# Altium schematic sheet SystemLevelAbbrev.SchDoc
size E
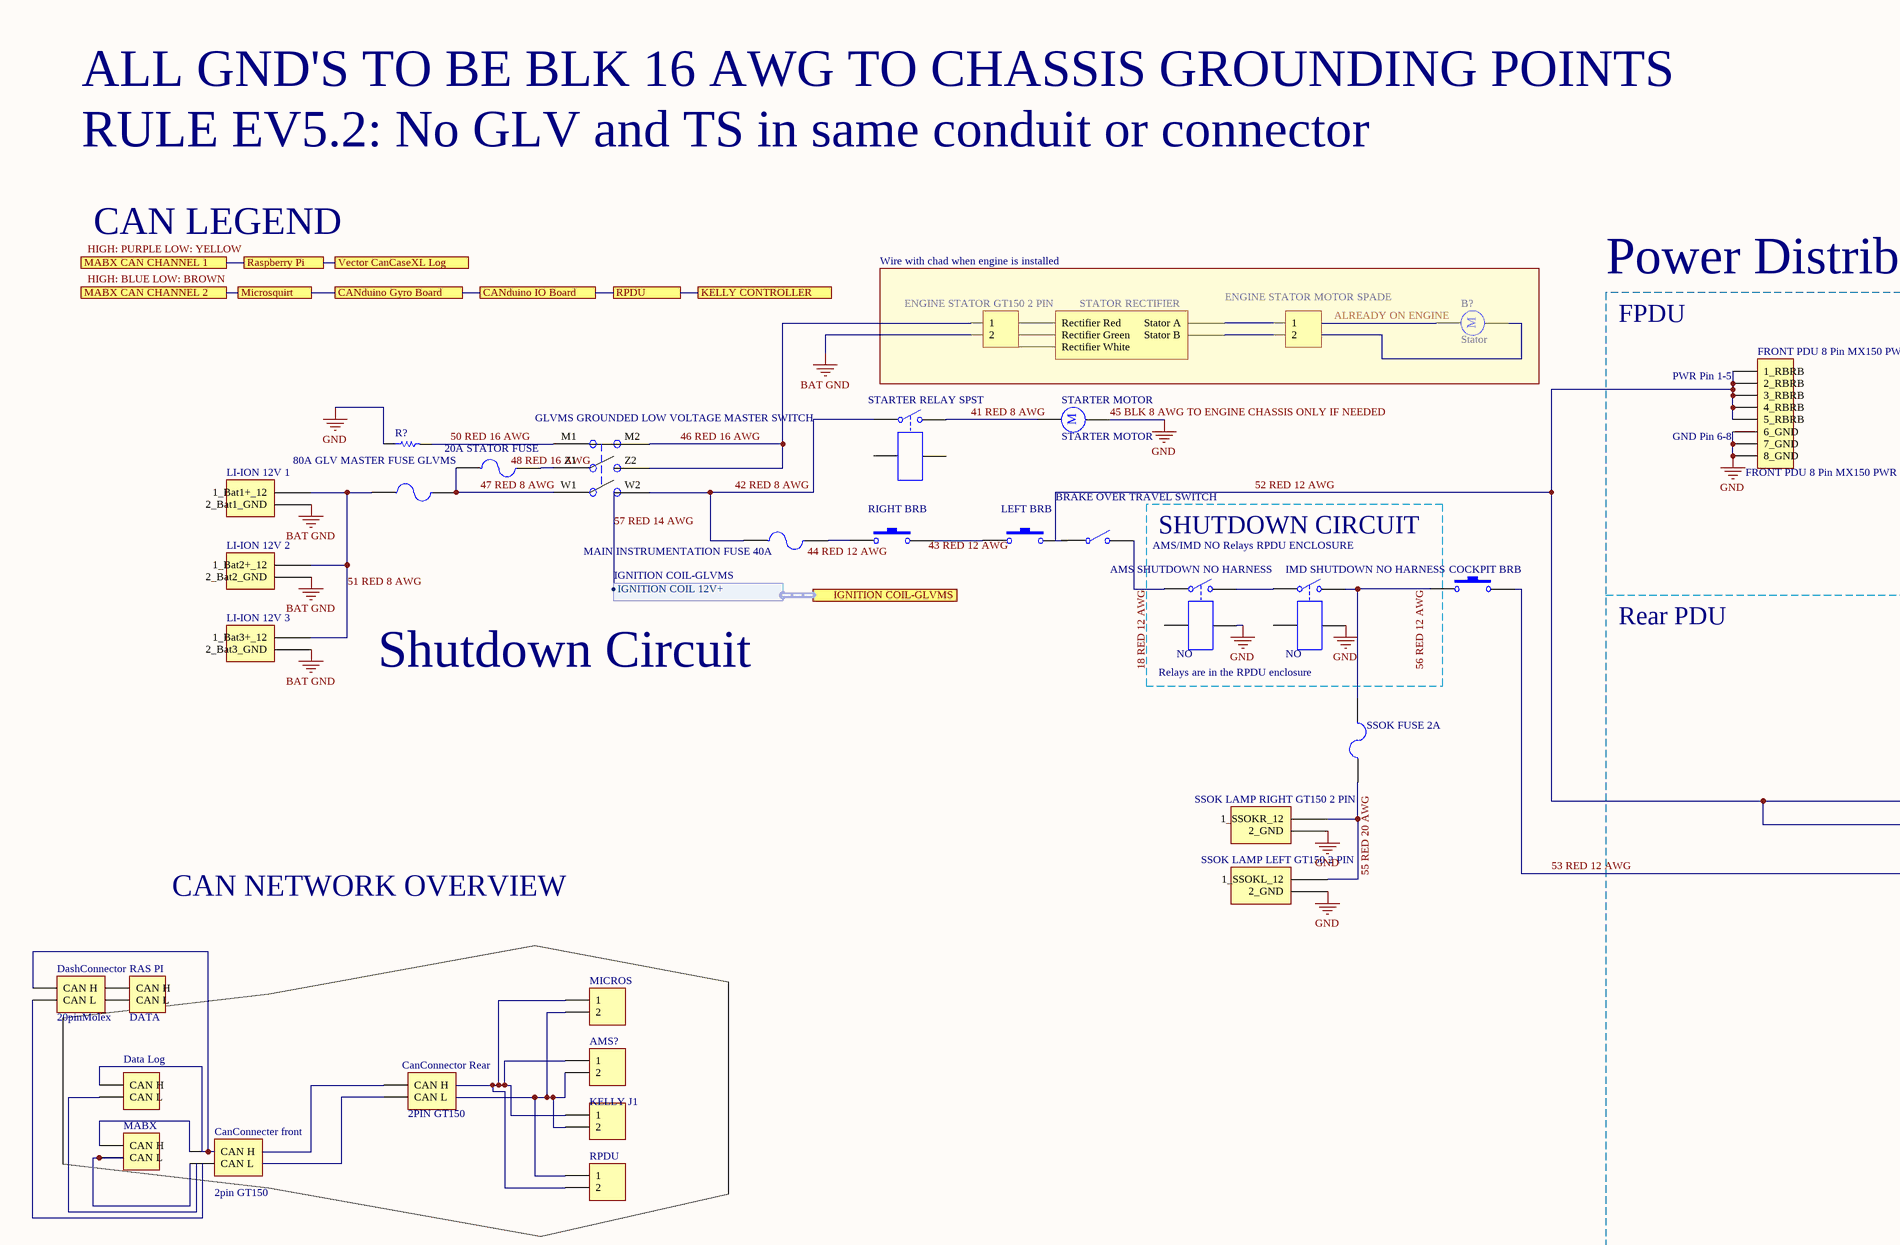
[diagram p0: SystemLevelAbbrev.SchDoc, top left]
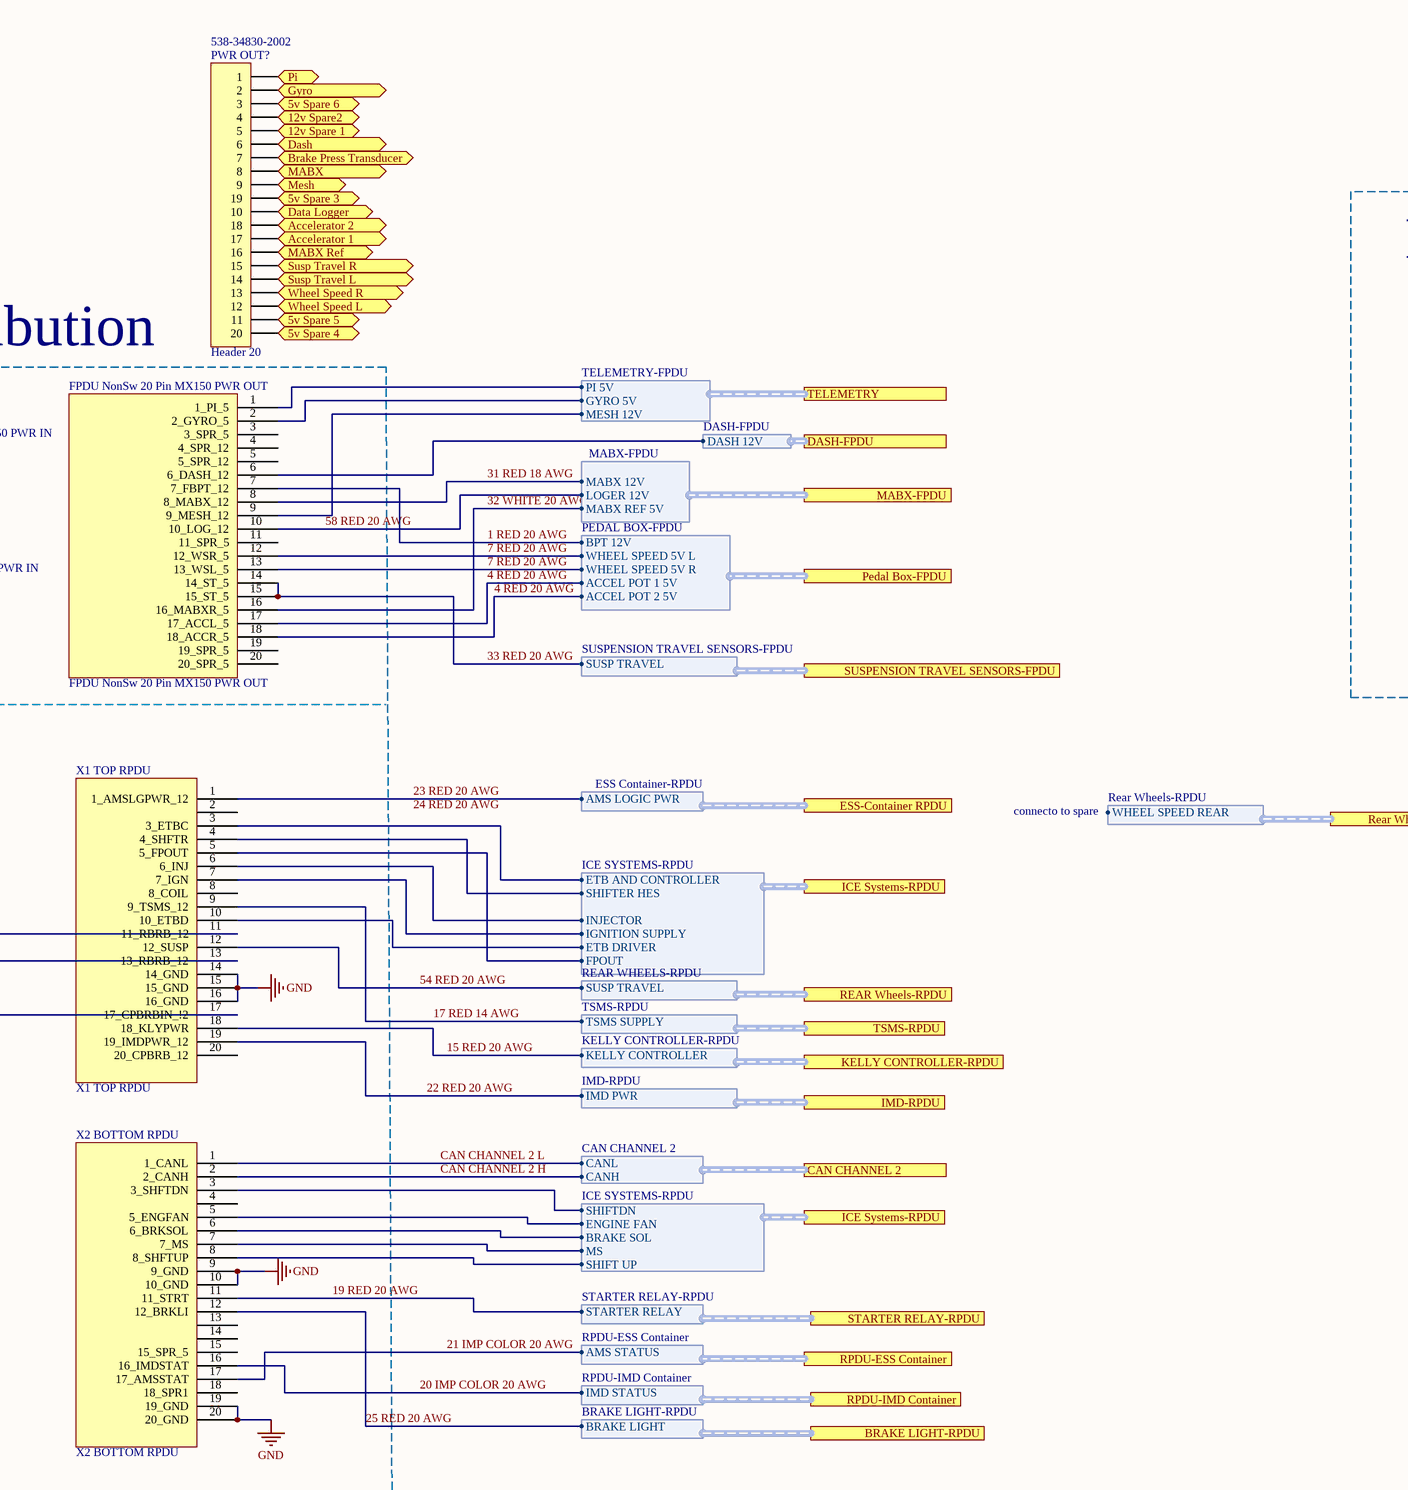
[diagram p1: SystemLevelAbbrev.SchDoc, top middle]
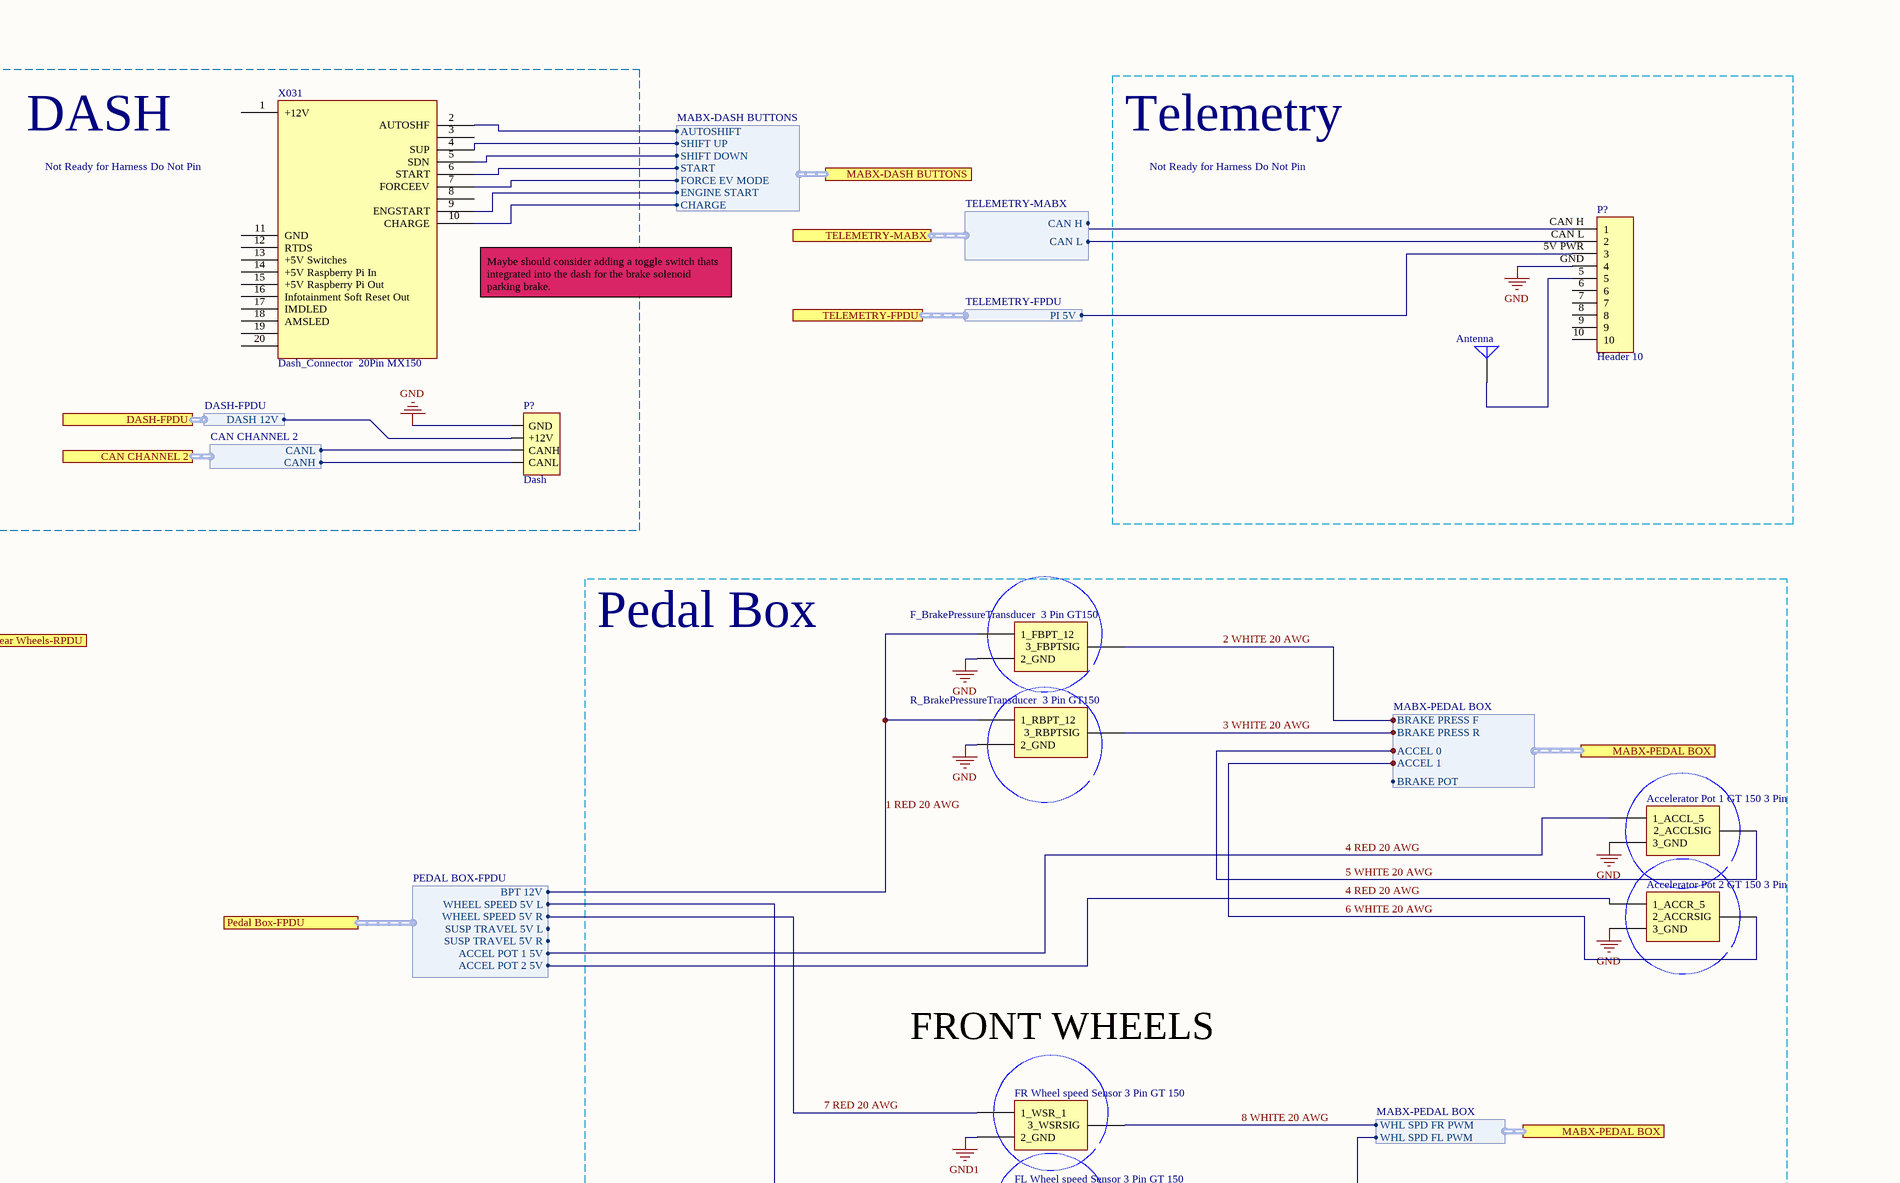
[diagram p2: SystemLevelAbbrev.SchDoc, top right]
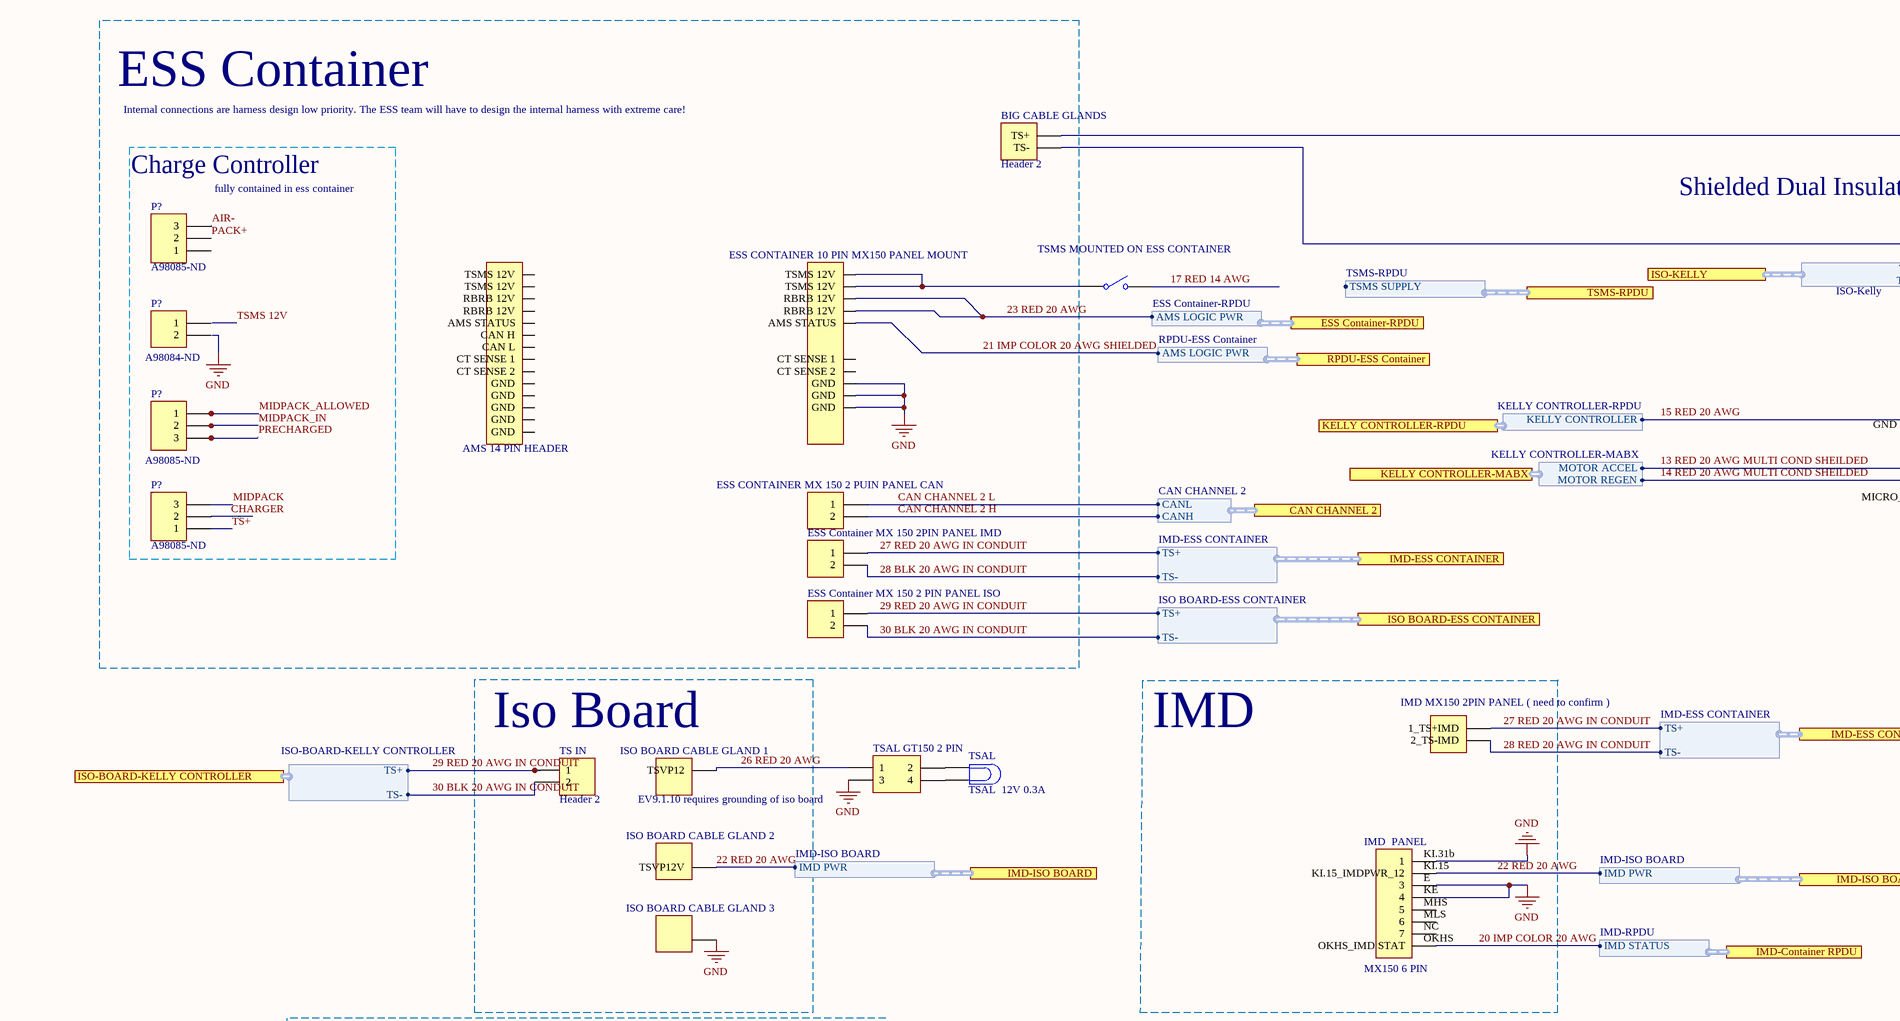
[diagram p3: SystemLevelAbbrev.SchDoc, centre left]
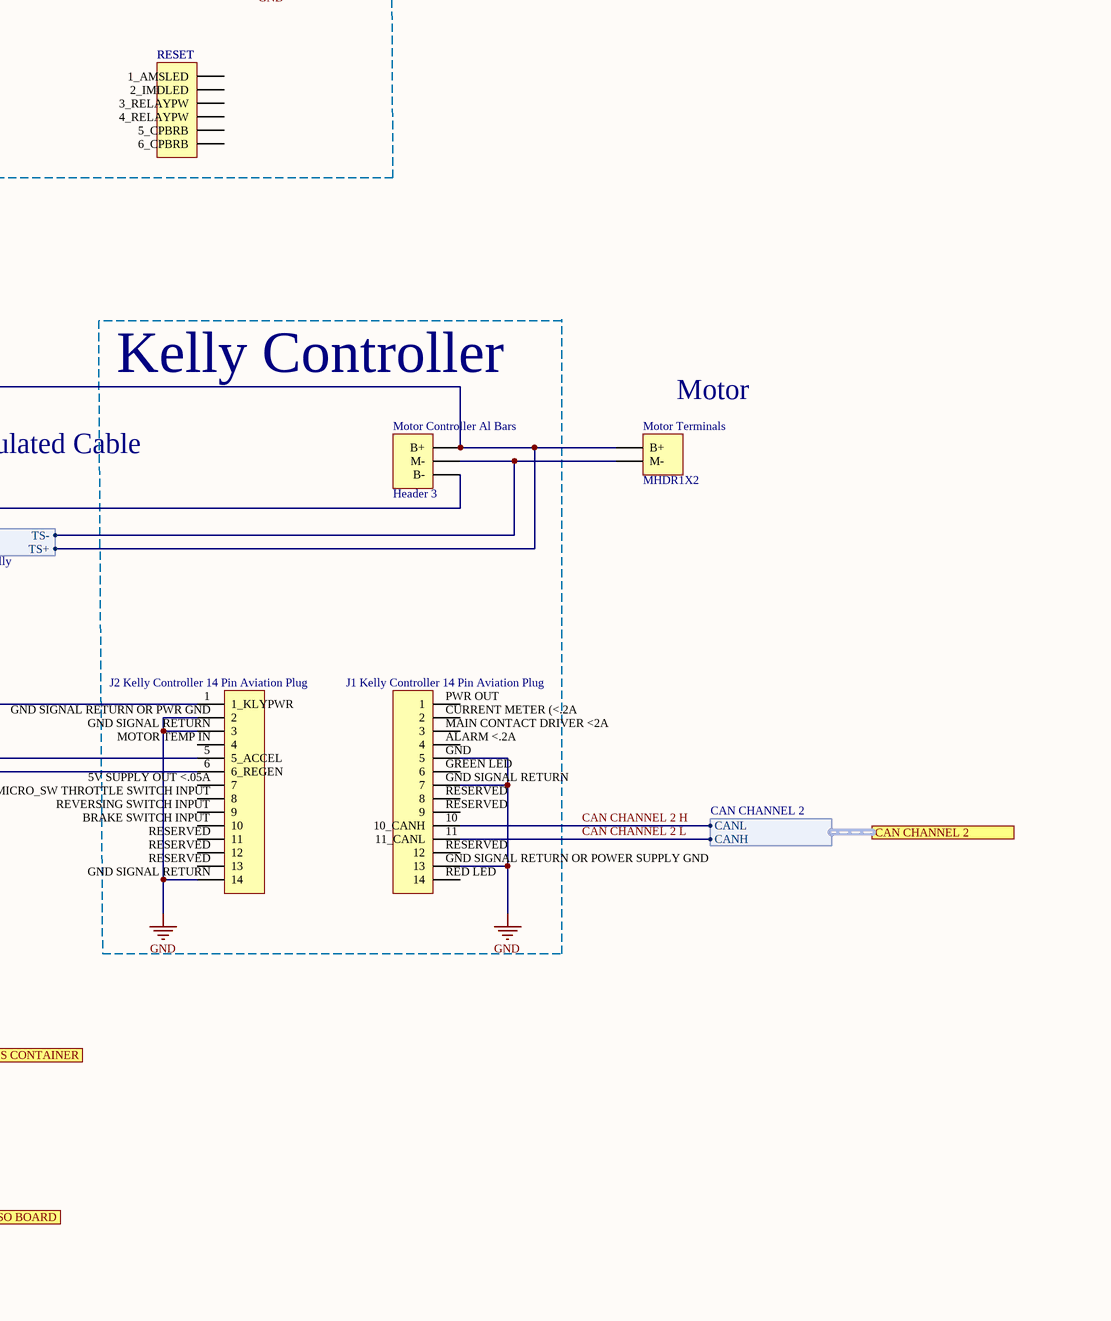
[diagram p4: SystemLevelAbbrev.SchDoc, centre middle]
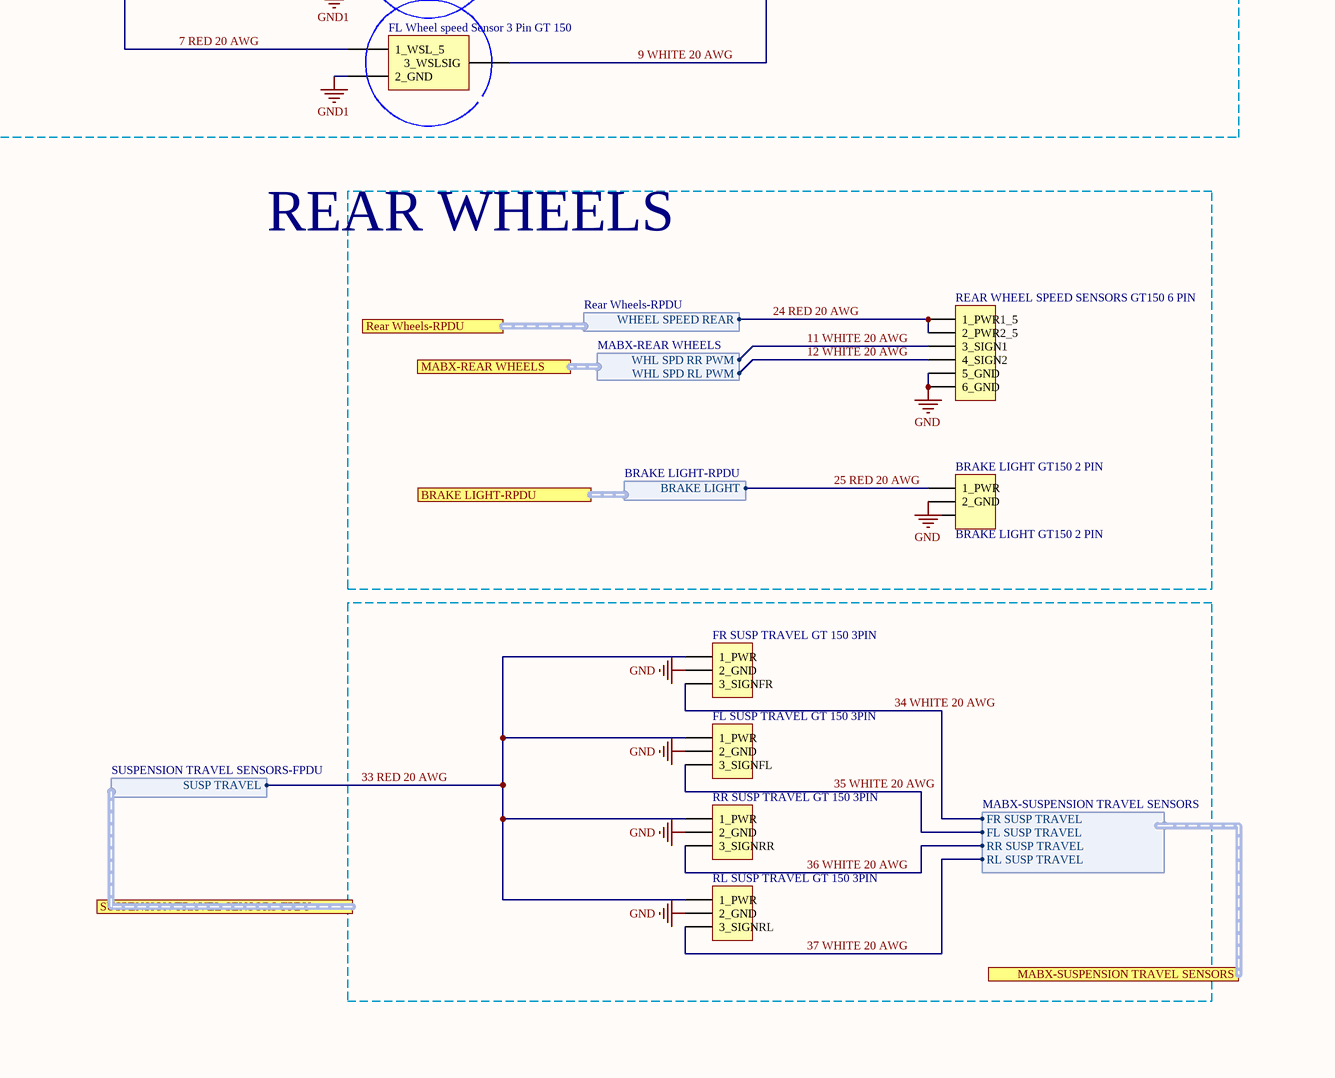
[diagram p5: SystemLevelAbbrev.SchDoc, centre right]
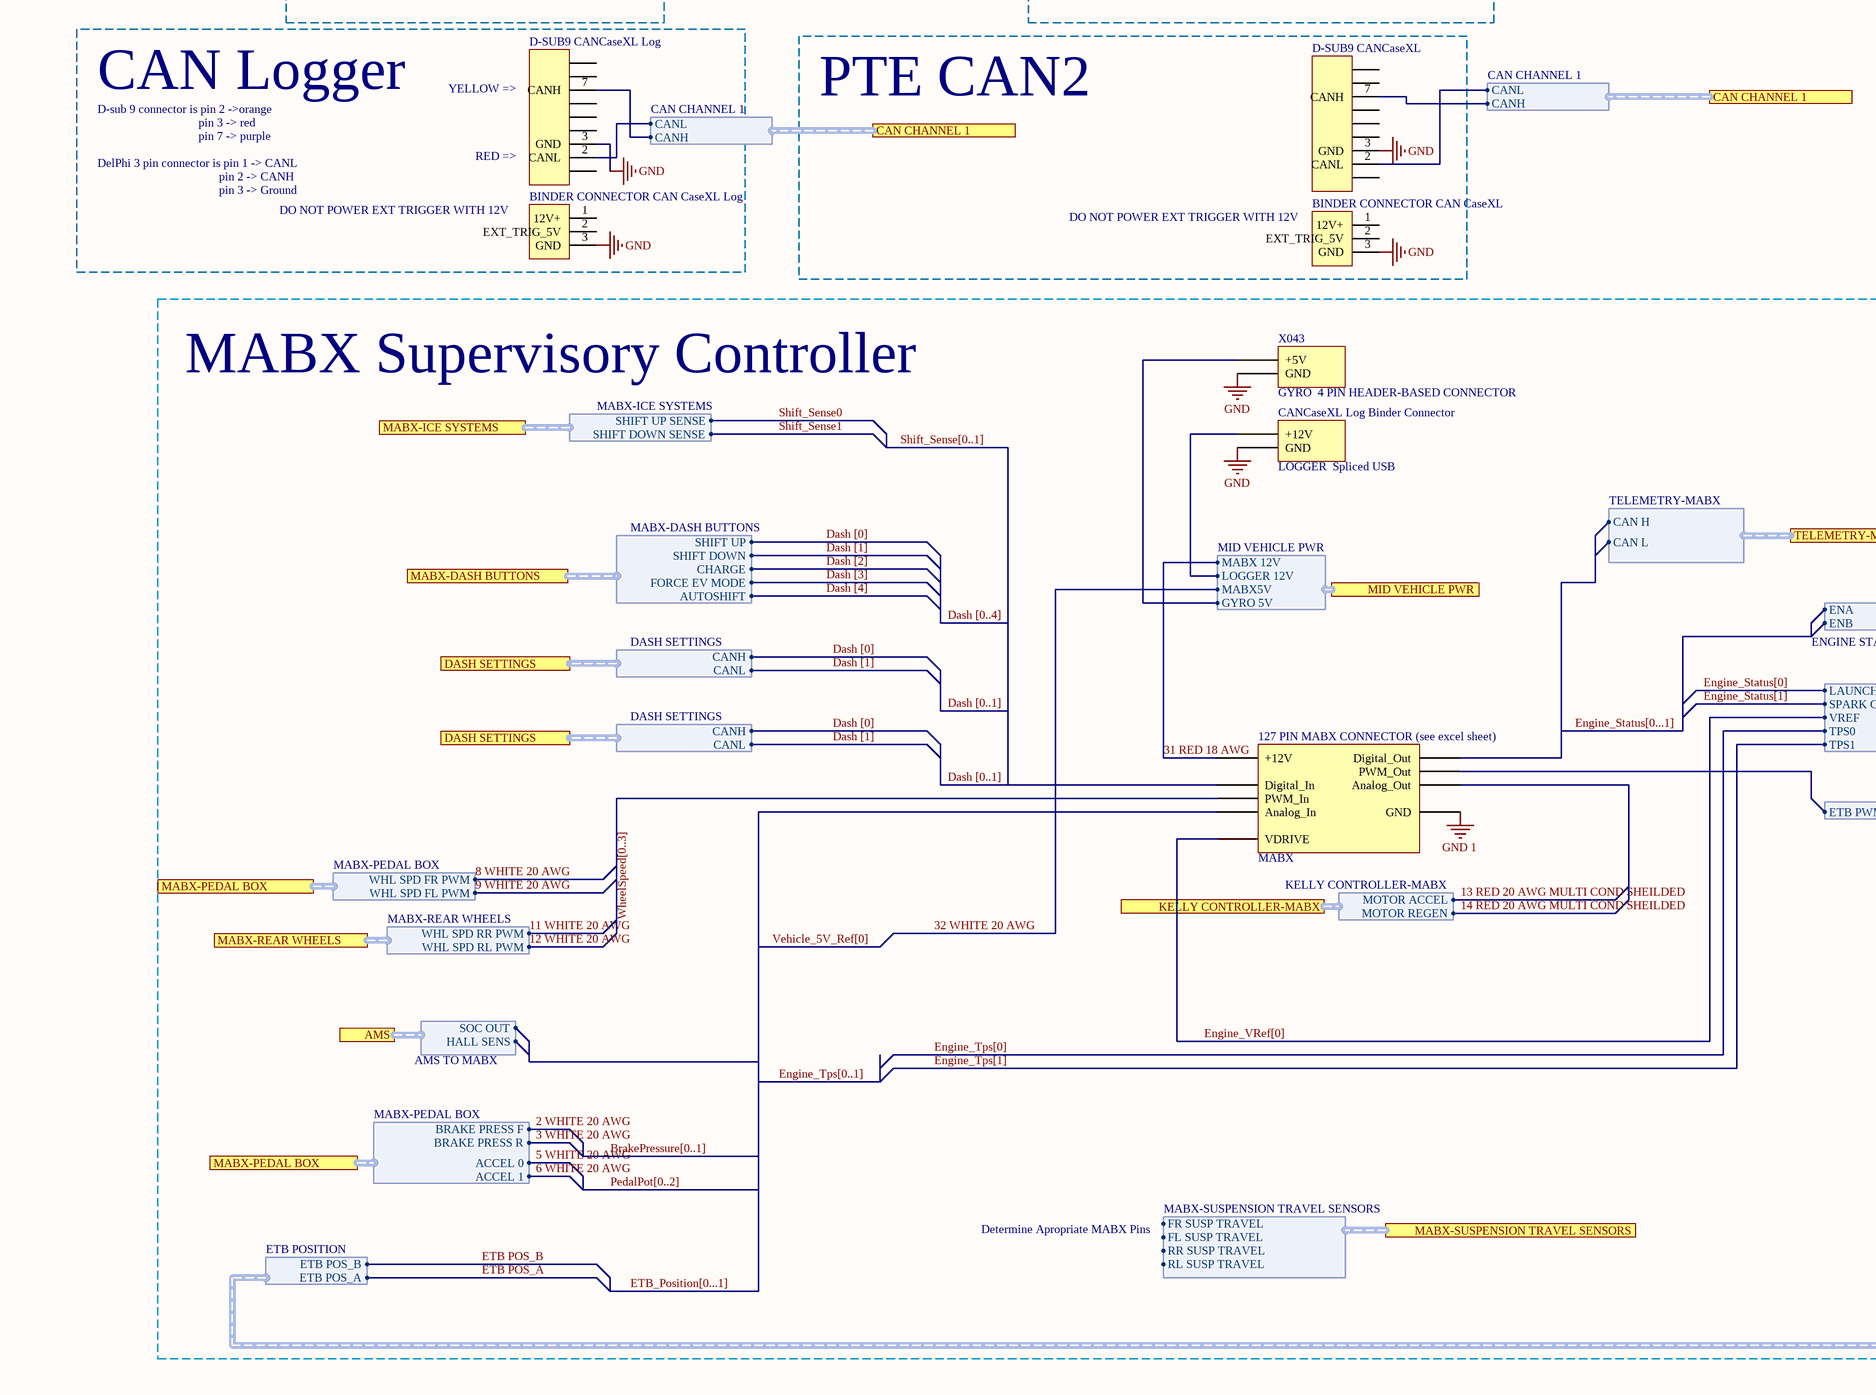
[diagram p6: SystemLevelAbbrev.SchDoc, bottom left]
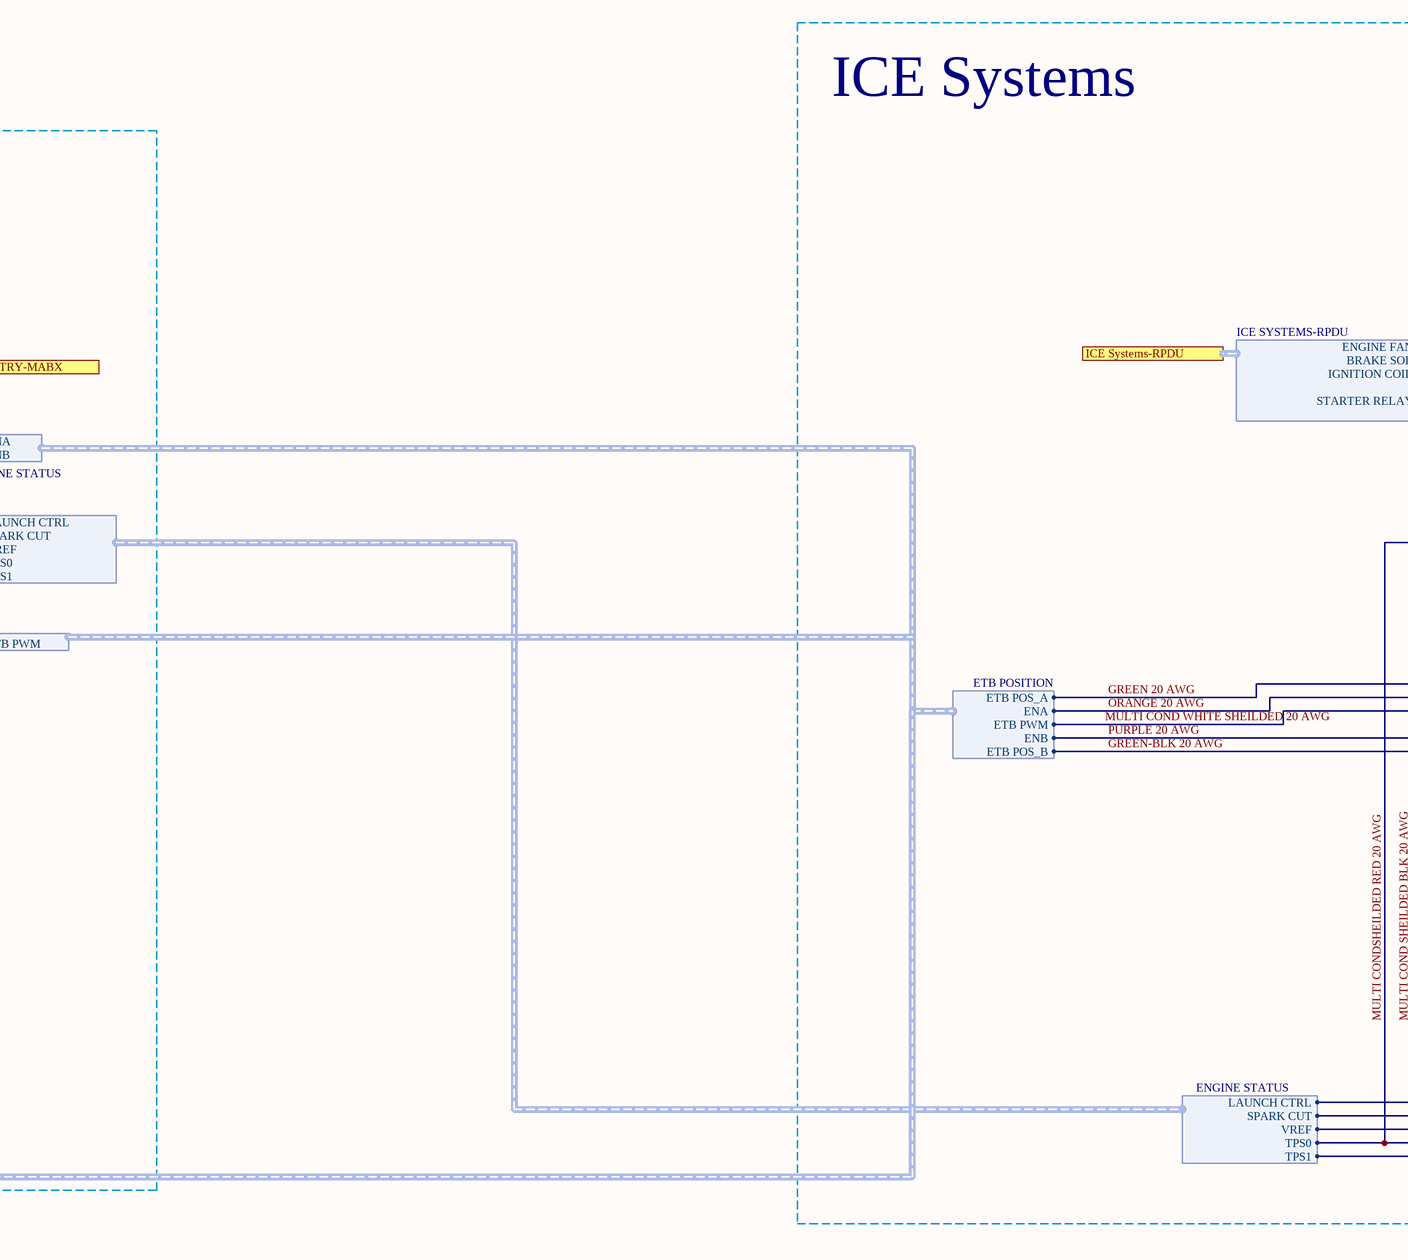
[diagram p7: SystemLevelAbbrev.SchDoc, bottom middle]
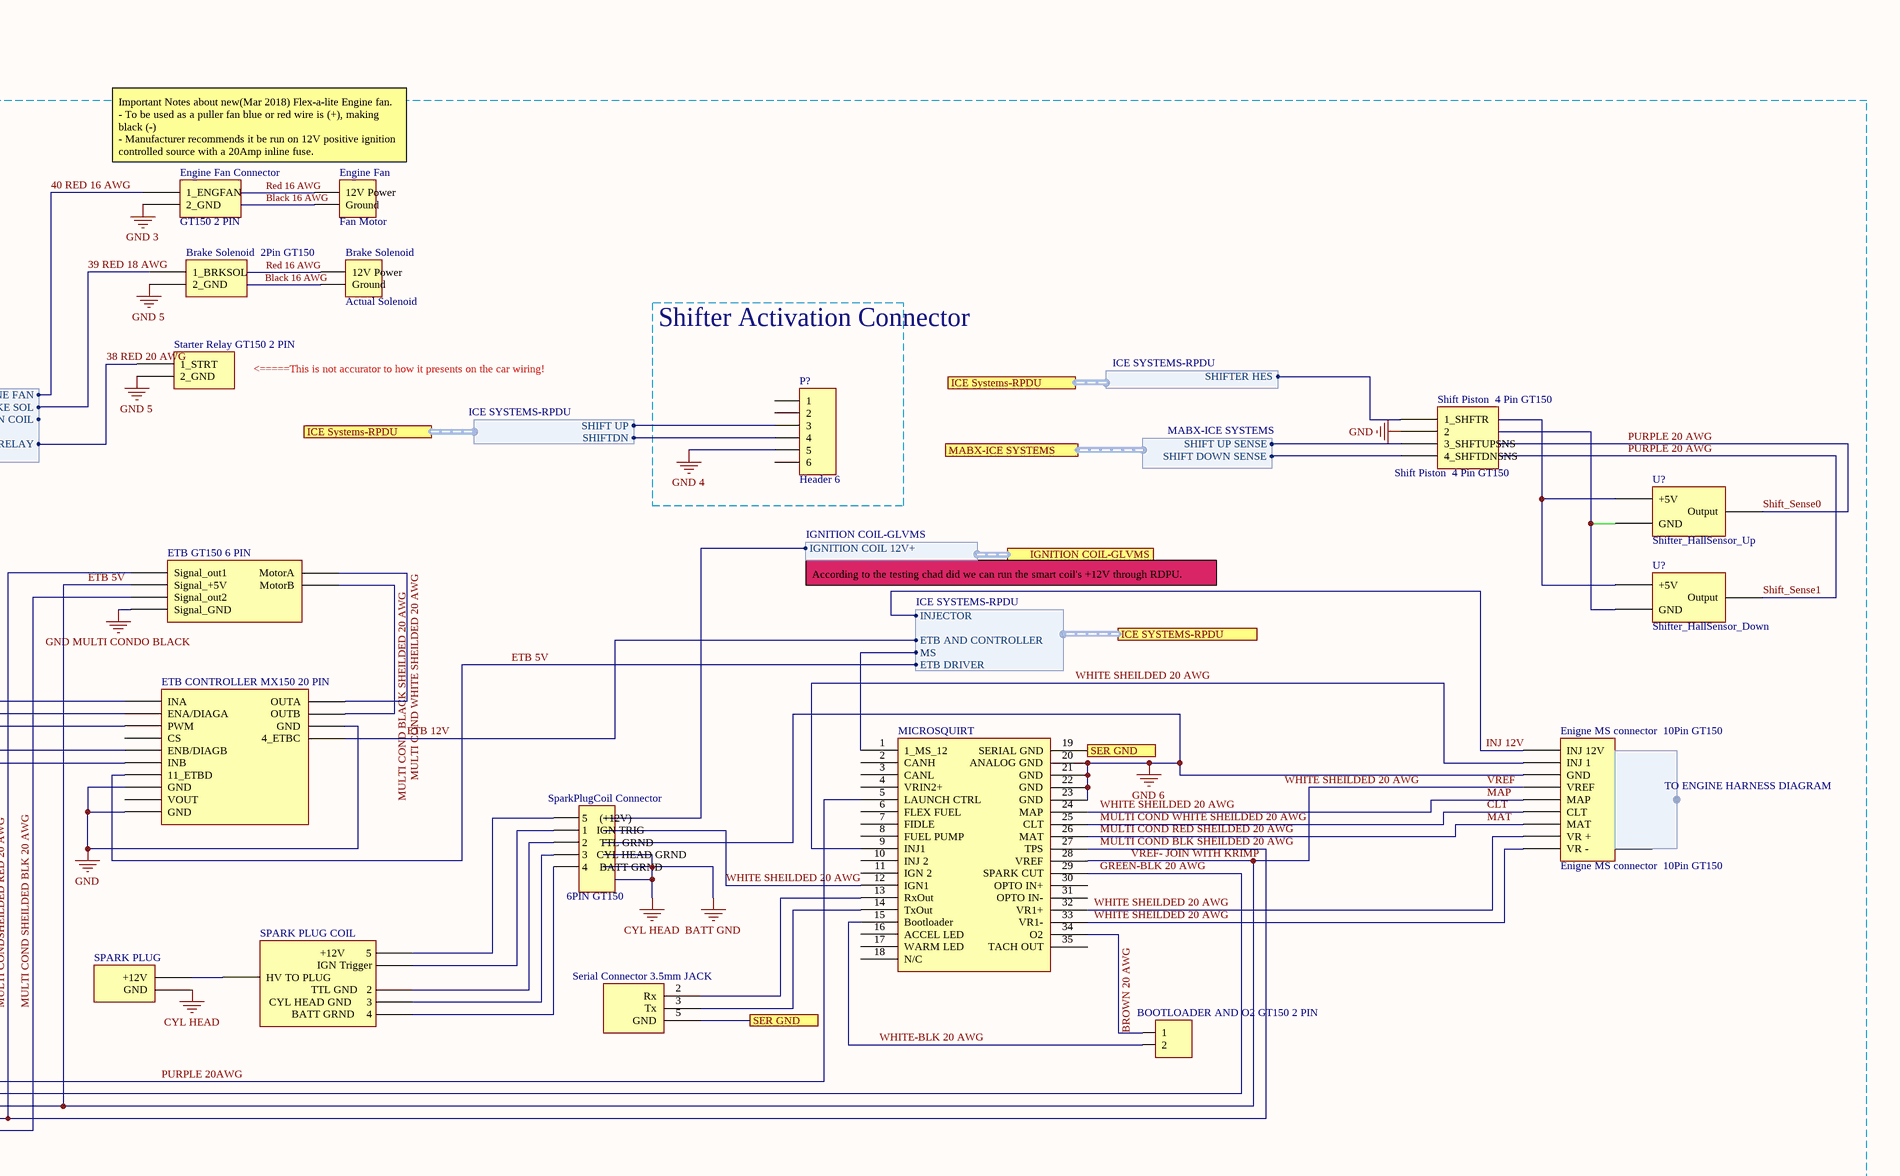
[diagram p8: SystemLevelAbbrev.SchDoc, bottom right]

## Parts
(Parts that share a designator on the sheet are numbered #1, #2 ... from top to bottom, then left to right.)
20A_STATOR_FUSE  20A Stator Fuse  (value not drawn)
80A_GLV_MASTER_FUSE_GLVMS  80A GLV MASTER FUSE GLVMS  (value not drawn)
127_PIN_MABX_CONNECTOR_(see_excel_sheet)  MABX
?#1  Antenna  [PIN1]
?#2  Data Log  [HDR1X2H]
Accelerator_Pot_1_GT_150_3_Pin  Accelerator Pot 1 GT 150 3 Pin  (value not drawn)
Accelerator_Pot_2_GT_150_3_Pin  Accelerator Pot 2 GT 150 3 Pin  (value not drawn)
AMS?  (no value)  [HDR1X2H]
AMS_14_PIN_HEADER  14 Pin Connector  [TE Connectivity 14 Pin]  (value not drawn)
AMS_SHUTDOWN_NO_HARNESS  NO  [MODULE4]
B?  Stator  [RB5-10.5]
BIG_CABLE_GLANDS  Header 2  [HDR1X2]
BINDER_CONNECTOR_CAN_CaseXL  Header 3  [HDR1X3]  (value not drawn)
BINDER_CONNECTOR_CAN_CaseXL_Log  Header 3  [HDR1X3]  (value not drawn)
BOOTLOADER_AND_O2_GT150_2_PIN  2 Pin GT150  (value not drawn)
BRAKE_LIGHT_GT150_2_PIN  BRAKE LIGHT GT150 2 PIN  [HDR1X3]
BRAKE_OVER_TRAVEL_SWITCH  BRAKE OVER TRAVEL SWITCH  (value not drawn)
Brake_Solenoid  Actual Solenoid  [HDR1X2]
Brake_Solenoid_2Pin_GT150  Brake Solenoid  2Pin GT150  (value not drawn)
CANCaseXL_Log_Binder_Connector  LOGGER  Spliced USB
CanConnecter_front  2pin GT150  [HDR2X2]
CanConnector_Rear  2PIN GT150  [HDR2X2]
COCKPIT_BRB  COCKPIT BRB  (value not drawn)
D-SUB9_CANCaseXL  Header 9  [HDR1X9]  (value not drawn)
D-SUB9_CANCaseXL_Log  Header 9  [HDR1X9]  (value not drawn)
DashConnector  20pinMolex  [HDR2X2]
Engine_Fan  Fan Motor  [HDR1X2]
Engine_Fan_Connector  GT150 2 PIN
ENGINE_STATOR_GT150_2_PIN  2 Pin GT150  (value not drawn)
ENGINE_STATOR_MOTOR_SPADE  2x Spade  (value not drawn)
Enigne_MS_connector_10Pin_GT150  Enigne MS connector  10Pin GT150  [RAD-0.3]
ESS_CONTAINER_10_PIN_MX150_PANEL_MOUNT  14 Pin Connector  [TE Connectivity 14 Pin]  (value not drawn)
ESS_Container_MX_150_2_PIN_PANEL_ISO  Header 2  [HDR1X2]  (value not drawn)
ESS_CONTAINER_MX_150_2_PUIN_PANEL_CAN  Header 2  [HDR1X2]  (value not drawn)
ESS_Container_MX_150_2PIN_PANEL_IMD  Header 2  [HDR1X2]  (value not drawn)
ETB_CONTROLLER_MX150_20_PIN  ETB CONTROLLER MX150 20 PIN  (value not drawn)
ETB_GT150_6_PIN  ETB  6Pin GT150  (value not drawn)
F_BrakePressureTransducer_3_Pin_GT150  F_BrakePressureTransducer  3 Pin GT150  (value not drawn)
FL_SUSP_TRAVEL_GT_150_3PIN  FL SUSP TRAVEL GT 150 3PIN  [HDR1X3]  (value not drawn)
FL_Wheel_speed_Sensor_3_Pin_GT_150  FL_Wheel_Speed_Sensor  3 Pin GT150  (value not drawn)
FPDU_NonSw_20_Pin_MX150_PWR_OUT  FPDU NonSw 20 Pin MX150 PWR OUT
FR_SUSP_TRAVEL_GT_150_3PIN  FR SUSP TRAVEL GT 150 3PIN  [HDR1X3]  (value not drawn)
FR_Wheel_speed_Sensor_3_Pin_GT_150  FR_Wheel_Speed_Sensor  3 Pin GT150  (value not drawn)
FRONT_PDU_8_Pin_MX150_PWR_IN  FRONT PDU 8 Pin MX150 PWR IN  [HDR1X8]
GLVMS_GROUNDED_LOW_VOLTAGE_MASTER_SWITCH  GLVMS GROUNDED LOW VOLTAGE MASTER SWITCH  (value not drawn)
IMD_MX150_2PIN_PANEL_(_need_to_confirm_)  IMD MX150 2PIN PANEL ( need to confirm )  [HDR1X2]  (value not drawn)
IMD_PANEL  MX150 6 PIN  [HDR1X8]
IMD_SHUTDOWN_NO_HARNESS  NO  [MODULE4]
ISO_BOARD_CABLE_GLAND_1  Header 1  [2 Pin Screw Terminal]  (value not drawn)
ISO_BOARD_CABLE_GLAND_2  Header 2  [HDR1X2]  (value not drawn)
ISO_BOARD_CABLE_GLAND_3  Header 2  [HDR1X2]  (value not drawn)
J1_Kelly_Controller_14_Pin_Aviation_Plug  J1 Kelly Controller 14 Pin Aviation Plug  [HDR1X14]  (value not drawn)
J2_Kelly_Controller_14_Pin_Aviation_Plug  J1 Kelly Controller 14 Pin Aviation Plug  [HDR1X14]  (value not drawn)
KELLY_J1  (no value)  [HDR1X2H]
LEFT_BRB  Left BRB  (value not drawn)
LI-ION_12V_1  LI-ION 12V 1  (value not drawn)
LI-ION_12V_2  LI-ION 12V 2  (value not drawn)
LI-ION_12V_3  LI-ION 12V 3  (value not drawn)
MABX  (no value)  [HDR1X2H]
MAIN_INSTRUMENTATION_FUSE_40A  MAIN INSTRUMENTATION FUSE 20A  (value not drawn)
MICROS  (no value)  [HDR1X2H]
MICROSQUIRT  Microsquirt  (value not drawn)
Motor_Controller_Al_Bars  Header 3  [HDR1X3]
Motor_Terminals  MHDR1X2  [MHDR1X2]
P?#1  Header 10  [HDR1X10]
P?#2  Dash
P?#3  Supplier Part Number: A98085-ND  [3 Pos wire to board]  (hidden comment: Header 3)
P?#4  Supplier Part Number: A98084-ND  [2 Pos wire to board]  (hidden comment: Header 2)
P?#5  Supplier Part Number: A98085-ND  [3 Pos wire to board]  (hidden comment: Header 3)
P?#6  Supplier Part Number: A98085-ND  [3 Pos wire to board]  (hidden comment: Header 3)
P?#7  Header 6  [HDR1X6]
PWR_OUT?  Header 20  Supplier Part Number 1: 538-34830-2002  [MX150 20 PIN]
R?  Res1  [AXIAL-0.3]  (value not drawn)
R_BrakePressureTransducer_3_Pin_GT150  R_BrakePressureTransducer  3 Pin GT150  (value not drawn)
RAS_PI  DATA  [HDR1X2H]
REAR_WHEEL_SPEED_SENSORS_GT150_6_PIN  REAR WHEEL SPEED SENSORS GT150 6 PIN  [HDR1X6]  (value not drawn)
RESET  RESET  [HDR1X6]
RIGHT_BRB  Right BRB  (value not drawn)
RL_SUSP_TRAVEL_GT_150_3PIN  RL SUSP TRAVEL GT 150 3PIN  [HDR1X3]  (value not drawn)
RPDU  (no value)  [HDR1X2H]
RR_SUSP_TRAVEL_GT_150_3PIN  RR SUSP TRAVEL GT 150 3PIN  [HDR1X3]  (value not drawn)
Serial_Connector_3.5mm_JACK  Serial_Connector  (value not drawn)
Shift_Piston_4_Pin_GT150  Shift Piston  4 Pin GT150  [RAD-0.3]
SPARK_PLUG  SPARK PLUG  (value not drawn)
SPARK_PLUG_COIL  Spark Plug Coil  (value not drawn)
SparkPlugCoil_Connector  6PIN GT150  [HDR1X6]
SSOK_FUSE_2A  SSOK FUSE  [PIN-W2/E2.8]  (value not drawn)
SSOK_LAMP_LEFT_GT150_2_PIN  SSOK Lamp Left  (value not drawn)
SSOK_LAMP_RIGHT_GT150_2_PIN  SSOK LAMP RIGHT  (value not drawn)
STARTER_MOTOR  STARTER MOTOR
Starter_Relay_GT150_2_PIN  STARTER RELAY GT150 2 PIN  (value not drawn)
STARTER_RELAY_SPST  STARTER RELAY SPST  [MODULE4]  (value not drawn)
STATOR_RECTIFIER  Stator Rectifier  (value not drawn)
TS_IN  Header 2  [HDR1X2]
TSAL  TSAL  12V 0.3A  [PIN2]
TSAL_GT150_2_PIN  Header 2X2  [HDR2X2]  (value not drawn)
TSMS_MOUNTED_ON_ESS_CONTAINER  TSMS  (value not drawn)
U?#1  Shifter_HallSensor_Up
U?#2  Shifter_HallSensor_Down
X1_TOP_RPDU  X1 TOP RPDU
X2_BOTTOM_RPDU  X2 BOTTOM RPDU
X031  Dash_Connector  20Pin MX150
X043  GYRO  4 PIN HEADER-BASED CONNECTOR

## Blocks framed on the sheet
DASH: P?#2 X031
Telemetry: ?#1 P?#1
Wire with chad when engine is installed: B? ENGINE_STATOR_GT150_2_PIN ENGINE_STATOR_MOTOR_SPADE STATOR_RECTIFIER
Power Distribution: FPDU_NonSw_20_Pin_MX150_PWR_OUT FRONT_PDU_8_Pin_MX150_PWR_IN RESET X1_TOP_RPDU X2_BOTTOM_RPDU
SHUTDOWN CIRCUIT: AMS_SHUTDOWN_NO_HARNESS IMD_SHUTDOWN_NO_HARNESS
Pedal Box: Accelerator_Pot_1_GT_150_3_Pin Accelerator_Pot_2_GT_150_3_Pin F_BrakePressureTransducer_3_Pin_GT150 FL_Wheel_speed_Sensor_3_Pin_GT_150 FR_Wheel_speed_Sensor_3_Pin_GT_150 R_BrakePressureTransducer_3_Pin_GT150
ESS Container: AMS_14_PIN_HEADER BIG_CABLE_GLANDS ESS_CONTAINER_10_PIN_MX150_PANEL_MOUNT ESS_Container_MX_150_2_PIN_PANEL_ISO ESS_CONTAINER_MX_150_2_PUIN_PANEL_CAN ESS_Container_MX_150_2PIN_PANEL_IMD
Kelly Controller: J1_Kelly_Controller_14_Pin_Aviation_Plug J2_Kelly_Controller_14_Pin_Aviation_Plug Motor_Controller_Al_Bars
Charge Controller: P?#3-P?#6
Iso Board: ISO_BOARD_CABLE_GLAND_1-ISO_BOARD_CABLE_GLAND_3 TS_IN
IMD: IMD_MX150_2PIN_PANEL_(_need_to_confirm_) IMD_PANEL
CAN Logger: BINDER_CONNECTOR_CAN_CaseXL_Log D-SUB9_CANCaseXL_Log
PTE CAN2: BINDER_CONNECTOR_CAN_CaseXL D-SUB9_CANCaseXL
ICE Systems: BOOTLOADER_AND_O2_GT150_2_PIN Brake_Solenoid Brake_Solenoid_2Pin_GT150 Engine_Fan Engine_Fan_Connector Enigne_MS_connector_10Pin_GT150 ETB_CONTROLLER_MX150_20_PIN ETB_GT150_6_PIN MICROSQUIRT Serial_Connector_3.5mm_JACK Shift_Piston_4_Pin_GT150 SPARK_PLUG SPARK_PLUG_COIL SparkPlugCoil_Connector Starter_Relay_GT150_2_PIN U?#1 U?#2
MABX Supervisory Controller: 127_PIN_MABX_CONNECTOR_(see_excel_sheet) CANCaseXL_Log_Binder_Connector X043
Shifter Activation Connector: P?#7

## Ports
5v Spare 3, 5v Spare 4, 5v Spare 5, 5v Spare 6, 12v Spare2, 12v Spare 1, Accelerator 1, Accelerator 2, AMS (harness AMS TO MABX), BRAKE LIGHT-RPDU (harness BRAKE LIGHT-RPDU), Brake Press Transducer, CAN CHANNEL 1 (harness CAN CHANNEL 1), CAN CHANNEL 2 (harness CAN CHANNEL 2), CANduino Gyro Board, CANduino IO Board, Dash, DASH SETTINGS (harness DASH SETTINGS), DASH-FPDU (harness DASH-FPDU), Data Logger, ESS Container-RPDU (harness ESS Container-RPDU), ESS-Container RPDU (harness ESS Container-RPDU), Gyro, ICE SYSTEMS-RPDU (harness ICE SYSTEMS-RPDU), ICE Systems-RPDU (harness ICE SYSTEMS-RPDU), IGNITION COIL-GLVMS (harness IGNITION COIL-GLVMS), IMD-Container RPDU (harness IMD-RPDU), IMD-ESS CONTAINER (harness IMD-ESS CONTAINER), IMD-ISO BOARD (harness IMD-ISO BOARD), IMD-RPDU (harness IMD-RPDU), ISO BOARD-ESS CONTAINER (harness ISO BOARD-ESS CONTAINER), ISO-BOARD-KELLY CONTROLLER (harness ISO-BOARD-KELLY CONTROLLER), ISO-KELLY (harness ISO-Kelly), KELLY CONTROLLER, KELLY CONTROLLER-MABX (harness KELLY CONTROLLER-MABX), KELLY CONTROLLER-RPDU (harness KELLY CONTROLLER-RPDU), MABX, MABX CAN CHANNEL 1, MABX CAN CHANNEL 2, MABX Ref, MABX-DASH BUTTONS (harness MABX-DASH BUTTONS), MABX-FPDU (harness MABX-FPDU), MABX-ICE SYSTEMS (harness MABX-ICE SYSTEMS), MABX-PEDAL BOX (harness MABX-PEDAL BOX), MABX-REAR WHEELS (harness MABX-REAR WHEELS), MABX-SUSPENSION TRAVEL SENSORS (harness MABX-SUSPENSION TRAVEL SENSORS), Mesh, Microsquirt, MID VEHICLE PWR (harness MID VEHICLE PWR), Pedal Box-FPDU (harness PEDAL BOX-FPDU), Pi, Raspberry Pi, Rear Wheels-RPDU (harness Rear Wheels-RPDU), REAR Wheels-RPDU (harness REAR WHEELS-RPDU), RPDU, RPDU-ESS Container (harness RPDU-ESS Container), RPDU-IMD Container (harness RPDU-IMD Container), SER GND, STARTER RELAY-RPDU (harness STARTER RELAY-RPDU), Susp Travel L, Susp Travel R, SUSPENSION TRAVEL SENSORS-FPDU (harness SUSPENSION TRAVEL SENSORS-FPDU), TELEMETRY (harness TELEMETRY-FPDU), TELEMETRY-FPDU (harness TELEMETRY-FPDU), TELEMETRY-MABX (harness TELEMETRY-MABX), TSMS-RPDU (harness TSMS-RPDU), Vector CanCaseXL Log, Wheel Speed L, Wheel Speed R

## Harnesses
PEDAL BOX-FPDU: BPT 12V, ACCEL POT 1 5V, ACCEL POT 2 5V, WHEEL SPEED 5V R, WHEEL SPEED 5V L
MABX-FPDU: MABX 12V, LOGER 12V, MABX REF 5V
ETB POSITION: ETB POS_A, ETB PWM, ETB POS_B, ENA, ENB
ETB POSITION: ETB POS_A, ETB POS_B
MID VEHICLE PWR: MABX 12V, LOGGER 12V, GYRO 5V, MABX5V
MABX-ICE SYSTEMS: SHIFT UP SENSE, SHIFT DOWN SENSE
MABX-REAR WHEELS: WHL SPD RR PWM, WHL SPD RL PWM
MABX-PEDAL BOX: WHL SPD FR PWM, WHL SPD FL PWM
ENGINE STATUS: LAUNCH CTRL, SPARK CUT, VREF, TPS0, TPS1
MABX-PEDAL BOX: BRAKE PRESS F, BRAKE PRESS R, ACCEL 0, ACCEL 1
ICE SYSTEMS-RPDU: INJECTOR, ETB AND CONTROLLER, MS, ETB DRIVER
DASH SETTINGS: CANH, CANL
TO ENGINE HARNESS DIAGRAM: 
AMS TO MABX: SOC OUT, HALL SENS
Harness: ENA, ENB
Harness: ETB PWM
CAN CHANNEL 2: CANH, CANL
ISO-BOARD-KELLY CONTROLLER: TS-, TS+
TELEMETRY-FPDU: PI 5V, GYRO 5V, MESH 12V
IMD-ESS CONTAINER: TS-, TS+
TELEMETRY-MABX: CAN H, CAN L
TELEMETRY-FPDU: PI 5V
DASH-FPDU: DASH 12V
ESS Container-RPDU: AMS LOGIC PWR
Rear Wheels-RPDU: WHEEL SPEED REAR
ICE SYSTEMS-RPDU: ETB AND CONTROLLER, SHIFTER HES, INJECTOR, IGNITION SUPPLY, ETB DRIVER, FPOUT
TSMS-RPDU: TSMS SUPPLY
KELLY CONTROLLER-RPDU: KELLY CONTROLLER
CAN CHANNEL 2: CANL, CANH
ICE SYSTEMS-RPDU: SHIFTDN, ENGINE FAN, BRAKE SOL, MS, SHIFT UP
ICE SYSTEMS-RPDU: SHIFTDN, SHIFT UP
ICE SYSTEMS-RPDU: SHIFTER HES
ICE SYSTEMS-RPDU: IGNITION COIL, ENGINE FAN, BRAKE SOL, STARTER RELAY
RPDU-ESS Container: AMS STATUS
RPDU-IMD Container: IMD STATUS
IMD-RPDU: IMD STATUS
ISO-Kelly: TS-, TS+
KELLY CONTROLLER-MABX: MOTOR ACCEL, MOTOR REGEN
PEDAL BOX-FPDU: BPT 12V, ACCEL POT 1 5V, ACCEL POT 2 5V, SUSP TRAVEL 5V R, SUSP TRAVEL 5V L, WHEEL SPEED 5V R, WHEEL SPEED 5V L
MABX-PEDAL BOX: BRAKE PRESS F, BRAKE PRESS R, ACCEL 0, ACCEL 1, BRAKE POT
STARTER RELAY-RPDU: STARTER RELAY
RPDU-ESS Container: AMS LOGIC PWR
IMD-RPDU: IMD PWR
IMD-ISO BOARD: IMD PWR
BRAKE LIGHT-RPDU: BRAKE LIGHT
ISO BOARD-ESS CONTAINER: TS-, TS+
SUSPENSION TRAVEL SENSORS-FPDU: SUSP TRAVEL
MABX-SUSPENSION TRAVEL SENSORS: FR SUSP TRAVEL, FL SUSP TRAVEL, RR SUSP TRAVEL, RL SUSP TRAVEL
MABX-DASH BUTTONS: SHIFT UP, SHIFT DOWN, CHARGE, FORCE EV MODE, AUTOSHIFT
MABX-DASH BUTTONS: SHIFT UP, SHIFT DOWN, CHARGE, FORCE EV MODE, AUTOSHIFT, ENGINE START, START
REAR WHEELS-RPDU: SUSP TRAVEL
IGNITION COIL-GLVMS: IGNITION COIL 12V+
CAN CHANNEL 1: CANL, CANH

## Nets
45 BLK 8 AWG TO ENGINE CHASSIS ONLY IF NEEDED: Accelerator_Pot_1_GT_150_3_Pin.3(3_GND) Accelerator_Pot_2_GT_150_3_Pin.3(3_GND) AMS_SHUTDOWN_NO_HARNESS.4 BINDER_CONNECTOR_CAN_CaseXL.3(GND) BINDER_CONNECTOR_CAN_CaseXL_Log.3(GND) BRAKE_LIGHT_GT150_2_PIN.2(2_GND) CANCaseXL_Log_Binder_Connector.2(GND) D-SUB9_CANCaseXL.3(GND) D-SUB9_CANCaseXL_Log.3(GND) ESS_CONTAINER_10_PIN_MX150_PANEL_MOUNT.10(GND) ESS_CONTAINER_10_PIN_MX150_PANEL_MOUNT.11(GND) ESS_CONTAINER_10_PIN_MX150_PANEL_MOUNT.12(GND) ETB_CONTROLLER_MX150_20_PIN.3(GND) ETB_CONTROLLER_MX150_20_PIN.12(GND) ETB_CONTROLLER_MX150_20_PIN.14(GND) F_BrakePressureTransducer_3_Pin_GT150.2(2_GND) FL_SUSP_TRAVEL_GT_150_3PIN.2(2_GND) FR_SUSP_TRAVEL_GT_150_3PIN.2(2_GND) FRONT_PDU_8_Pin_MX150_PWR_IN.6(6_GND) FRONT_PDU_8_Pin_MX150_PWR_IN.7(7_GND) FRONT_PDU_8_Pin_MX150_PWR_IN.8(8_GND) IMD_PANEL.E(3) IMD_PANEL.KE(4) IMD_PANEL.KI.31b(1) IMD_SHUTDOWN_NO_HARNESS.4 ISO_BOARD_CABLE_GLAND_3.1 J1_Kelly_Controller_14_Pin_Aviation_Plug.GND(5) J1_Kelly_Controller_14_Pin_Aviation_Plug.GND_SIGNAL_RETURN(7) J1_Kelly_Controller_14_Pin_Aviation_Plug.GND_SIGNAL_RETURN_OR_POWER_SUPPLY_GND(13) J2_Kelly_Controller_14_Pin_Aviation_Plug.GND_SIGNAL_RETURN(3) J2_Kelly_Controller_14_Pin_Aviation_Plug.GND_SIGNAL_RETURN_OR_PWR_GND(2) P?#1.GND(4) P?#2.1(GND) R?.1 R_BrakePressureTransducer_3_Pin_GT150.2(2_GND) REAR_WHEEL_SPEED_SENSORS_GT150_6_PIN.5(5_GND) REAR_WHEEL_SPEED_SENSORS_GT150_6_PIN.6(6_GND) RL_SUSP_TRAVEL_GT_150_3PIN.2(2_GND) RR_SUSP_TRAVEL_GT_150_3PIN.2(2_GND) Shift_Piston_4_Pin_GT150.2 SSOK_LAMP_LEFT_GT150_2_PIN.2(2_GND) SSOK_LAMP_RIGHT_GT150_2_PIN.2(2_GND) STARTER_MOTOR.2(2_GND) TSAL_GT150_2_PIN.3 X1_TOP_RPDU.14(14_GND) X1_TOP_RPDU.15(15_GND) X1_TOP_RPDU.16(16_GND) X2_BOTTOM_RPDU.9(9_GND) X2_BOTTOM_RPDU.10(10_GND) X2_BOTTOM_RPDU.19(19_GND) X2_BOTTOM_RPDU.20(20_GND) X043.2(GND)  [also labelled GND]
BAT GND: ENGINE_STATOR_GT150_2_PIN.2 LI-ION_12V_1.2(2_Bat1_GND) LI-ION_12V_2.2(2_Bat2_GND) LI-ION_12V_3.2(2_Bat3_GND)
BATT GND: SPARK_PLUG.2(GND)  [also labelled CYL HEAD]
GND1: FL_Wheel_speed_Sensor_3_Pin_GT_150.2(2_GND) FR_Wheel_speed_Sensor_3_Pin_GT_150.2(2_GND)
GND 1: 127_PIN_MABX_CONNECTOR_(see_excel_sheet).2(GND)
GND 3: Engine_Fan_Connector.2(2_GND)
GND 4: P?#7.5
GND 5: Brake_Solenoid_2Pin_GT150.2(2_GND) Starter_Relay_GT150_2_PIN.2(2_GND)
GND 6: Enigne_MS_connector_10Pin_GT150.25(GND) MICROSQUIRT.20(ANALOG_GND) MICROSQUIRT.21(GND) MICROSQUIRT.22(GND) MICROSQUIRT.23(GND)
GND MULTI CONDO BLACK: ETB_GT150_6_PIN.4(Signal_GND)
1 RED 20 AWG: F_BrakePressureTransducer_3_Pin_GT150.1(1_FBPT_12) FPDU_NonSw_20_Pin_MX150_PWR_OUT.7(7_FBPT_12) R_BrakePressureTransducer_3_Pin_GT150.1(1_RBPT_12) ; port Pedal Box-FPDU.BPT 12V
2 WHITE 20 AWG: F_BrakePressureTransducer_3_Pin_GT150.3(3_FBPTSIG) ; port MABX-PEDAL BOX.BRAKE PRESS F
3 WHITE 20 AWG: R_BrakePressureTransducer_3_Pin_GT150.3(3_RBPTSIG) ; port MABX-PEDAL BOX.BRAKE PRESS R
4 RED 20 AWG: Accelerator_Pot_1_GT_150_3_Pin.1(1_ACCL_5) Accelerator_Pot_2_GT_150_3_Pin.1(1_ACCR_5) FPDU_NonSw_20_Pin_MX150_PWR_OUT.17(17_ACCL_5) FPDU_NonSw_20_Pin_MX150_PWR_OUT.18(18_ACCR_5) ; port Pedal Box-FPDU.ACCEL POT 1 5V, port Pedal Box-FPDU.ACCEL POT 2 5V
5 WHITE 20 AWG: Accelerator_Pot_1_GT_150_3_Pin.2(2_ACCLSIG) ; port MABX-PEDAL BOX.ACCEL 0
5v Spare 3: PWR_OUT?.19 ; port 5v Spare 3
5v Spare 4: PWR_OUT?.20 ; port 5v Spare 4
5v Spare 5: PWR_OUT?.11 ; port 5v Spare 5
5v Spare 6: PWR_OUT?.3 ; port 5v Spare 6
6 WHITE 20 AWG: Accelerator_Pot_2_GT_150_3_Pin.2(2_ACCRSIG) ; port MABX-PEDAL BOX.ACCEL 1
7 RED 20 AWG: FL_Wheel_speed_Sensor_3_Pin_GT_150.1(1_WSL_5) FPDU_NonSw_20_Pin_MX150_PWR_OUT.12(12_WSR_5) FPDU_NonSw_20_Pin_MX150_PWR_OUT.13(13_WSL_5) FR_Wheel_speed_Sensor_3_Pin_GT_150.1(1_WSR_1) ; port Pedal Box-FPDU.WHEEL SPEED 5V R, port Pedal Box-FPDU.WHEEL SPEED 5V L
8 WHITE 20 AWG: FR_Wheel_speed_Sensor_3_Pin_GT_150.3(3_WSRSIG) ; port MABX-PEDAL BOX.WHL SPD FR PWM
9 WHITE 20 AWG: FL_Wheel_speed_Sensor_3_Pin_GT_150.3(3_WSLSIG) ; port MABX-PEDAL BOX.WHL SPD FL PWM
11 WHITE 20 AWG: REAR_WHEEL_SPEED_SENSORS_GT150_6_PIN.3(3_SIGN1) ; port MABX-REAR WHEELS.WHL SPD RR PWM
12 WHITE 20 AWG: REAR_WHEEL_SPEED_SENSORS_GT150_6_PIN.4(4_SIGN2) ; port MABX-REAR WHEELS.WHL SPD RL PWM
12v Spare2: PWR_OUT?.4 ; port 12v Spare2
12v Spare 1: PWR_OUT?.5 ; port 12v Spare 1
13 RED 20 AWG MULTI COND SHEILDED: J2_Kelly_Controller_14_Pin_Aviation_Plug.5(5_ACCEL) ; port KELLY CONTROLLER-MABX.MOTOR ACCEL
14 RED 20 AWG MULTI COND SHEILDED: J2_Kelly_Controller_14_Pin_Aviation_Plug.6(6_REGEN) ; port KELLY CONTROLLER-MABX.MOTOR REGEN
15 RED 20 AWG: J2_Kelly_Controller_14_Pin_Aviation_Plug.1(1_KLYPWR) X1_TOP_RPDU.18(18_KLYPWR) ; port KELLY CONTROLLER-RPDU.KELLY CONTROLLER
17 RED 14 AWG: TSMS_MOUNTED_ON_ESS_CONTAINER.2(NO) X1_TOP_RPDU.9(9_TSMS_12) ; port TSMS-RPDU.TSMS SUPPLY
18 RED 12 AWG: AMS_SHUTDOWN_NO_HARNESS.1 BRAKE_OVER_TRAVEL_SWITCH.2(2_GLV_12)
19 RED 20 AWG: X2_BOTTOM_RPDU.11(11_STRT) ; port STARTER RELAY-RPDU.STARTER RELAY
20 IMP COLOR 20 AWG: IMD_PANEL.OKHS(OKHS_IMD_STAT) X2_BOTTOM_RPDU.16(16_IMDSTAT) ; port RPDU-IMD Container.IMD STATUS, port IMD-Container RPDU.IMD STATUS
21 IMP COLOR 20 AWG: X2_BOTTOM_RPDU.17(17_AMSSTAT) ; port RPDU-ESS Container.AMS STATUS
21 IMP COLOR 20 AWG SHIELDED: ESS_CONTAINER_10_PIN_MX150_PANEL_MOUNT.5(AMS_STATUS) ; port RPDU-ESS Container.AMS LOGIC PWR
22 RED 20 AWG: IMD_PANEL.KI.15(KI.15_IMDPWR_12) ISO_BOARD_CABLE_GLAND_2.1(TSVP12V) X1_TOP_RPDU.19(19_IMDPWR_12) ; port IMD-RPDU.IMD PWR, port IMD-ISO BOARD.IMD PWR
23 RED 20 AWG: ESS_CONTAINER_10_PIN_MX150_PANEL_MOUNT.3(RBRB_12V) ESS_CONTAINER_10_PIN_MX150_PANEL_MOUNT.4(RBRB_12V) X1_TOP_RPDU.1(1_AMSLGPWR_12) ; port ESS-Container RPDU.AMS LOGIC PWR, port ESS Container-RPDU.AMS LOGIC PWR
24 RED 20 AWG: REAR_WHEEL_SPEED_SENSORS_GT150_6_PIN.1(1_PWR1_5) REAR_WHEEL_SPEED_SENSORS_GT150_6_PIN.2(2_PWR2_5) ; port Rear Wheels-RPDU.WHEEL SPEED REAR
25 RED 20 AWG: BRAKE_LIGHT_GT150_2_PIN.1(1_PWR) X2_BOTTOM_RPDU.12(12_BRKLI) ; port BRAKE LIGHT-RPDU.BRAKE LIGHT
26 RED 20 AWG: ISO_BOARD_CABLE_GLAND_1.1(TSVP12) TSAL_GT150_2_PIN.1
27 RED 20 AWG IN CONDUIT: ESS_Container_MX_150_2PIN_PANEL_IMD.1 IMD_MX150_2PIN_PANEL_(_need_to_confirm_).1(1_TS+IMD) ; port IMD-ESS CONTAINER.TS+
28 BLK 20 AWG IN CONDUIT: ESS_Container_MX_150_2PIN_PANEL_IMD.2 IMD_MX150_2PIN_PANEL_(_need_to_confirm_).2(2_TS-IMD) ; port IMD-ESS CONTAINER.TS-  [also labelled 28 RED 20 AWG IN CONDUIT]
29 RED 20 AWG IN CONDUIT: ESS_Container_MX_150_2_PIN_PANEL_ISO.1 TS_IN.1 ; port ISO-BOARD-KELLY CONTROLLER.TS+, port ISO BOARD-ESS CONTAINER.TS+
30 BLK 20 AWG IN CONDUIT: ESS_Container_MX_150_2_PIN_PANEL_ISO.2 TS_IN.2 ; port ISO-BOARD-KELLY CONTROLLER.TS-, port ISO BOARD-ESS CONTAINER.TS-
31 RED 18 AWG: 127_PIN_MABX_CONNECTOR_(see_excel_sheet).1(+12V) FPDU_NonSw_20_Pin_MX150_PWR_OUT.8(8_MABX_12) ; port MABX-FPDU.MABX 12V, port MID VEHICLE PWR.MABX 12V
32 WHITE 20 AWG: FPDU_NonSw_20_Pin_MX150_PWR_OUT.16(16_MABXR_5) ; port MABX-FPDU.MABX REF 5V, port MID VEHICLE PWR.MABX5V
33 RED 20 AWG: FL_SUSP_TRAVEL_GT_150_3PIN.1(1_PWR) FPDU_NonSw_20_Pin_MX150_PWR_OUT.14(14_ST_5) FPDU_NonSw_20_Pin_MX150_PWR_OUT.15(15_ST_5) FR_SUSP_TRAVEL_GT_150_3PIN.1(1_PWR) RL_SUSP_TRAVEL_GT_150_3PIN.1(1_PWR) RR_SUSP_TRAVEL_GT_150_3PIN.1(1_PWR) ; port SUSPENSION TRAVEL SENSORS-FPDU.SUSP TRAVEL
34 WHITE 20 AWG: FR_SUSP_TRAVEL_GT_150_3PIN.3(3_SIGNFR) ; harness MABX-SUSPENSION TRAVEL SENSORS.FR SUSP TRAVEL
35 WHITE 20 AWG: FL_SUSP_TRAVEL_GT_150_3PIN.3(3_SIGNFL) ; harness MABX-SUSPENSION TRAVEL SENSORS.FL SUSP TRAVEL
36 WHITE 20 AWG: RR_SUSP_TRAVEL_GT_150_3PIN.3(3_SIGNRR) ; harness MABX-SUSPENSION TRAVEL SENSORS.RR SUSP TRAVEL
37 WHITE 20 AWG: RL_SUSP_TRAVEL_GT_150_3PIN.3(3_SIGNRL) ; harness MABX-SUSPENSION TRAVEL SENSORS.RL SUSP TRAVEL
38 RED 20 AWG: Starter_Relay_GT150_2_PIN.1(1_STRT) ; port ICE SYSTEMS-RPDU.STARTER RELAY
39 RED 18 AWG: Brake_Solenoid_2Pin_GT150.1(1_BRKSOL) X2_BOTTOM_RPDU.6(6_BRKSOL) ; port ICE SYSTEMS-RPDU.BRAKE SOL
40 RED 16 AWG: Engine_Fan_Connector.1(1_ENGFAN) X2_BOTTOM_RPDU.5(5_ENGFAN) ; port ICE SYSTEMS-RPDU.ENGINE FAN
41 RED 8 AWG: STARTER_MOTOR.1(1_GLV) STARTER_RELAY_SPST.2(2_STRT_12)
42 RED 8 AWG: GLVMS_GROUNDED_LOW_VOLTAGE_MASTER_SWITCH.W2(M2_GLV+_12) MAIN_INSTRUMENTATION_FUSE_40A.1(1__INSTFU) STARTER_RELAY_SPST.1(1_GLV_12V)
46 RED 16 AWG: ENGINE_STATOR_GT150_2_PIN.1 GLVMS_GROUNDED_LOW_VOLTAGE_MASTER_SWITCH.M2(W2_STAT+) GLVMS_GROUNDED_LOW_VOLTAGE_MASTER_SWITCH.Z2(Z2_STAT+)
47 RED 8 AWG: 20A_STATOR_FUSE.1(1_STATFUS) 80A_GLV_MASTER_FUSE_GLVMS.2(2_GLVMS_12) GLVMS_GROUNDED_LOW_VOLTAGE_MASTER_SWITCH.W1(M1_BAT+_12)
50 RED 16 AWG: GLVMS_GROUNDED_LOW_VOLTAGE_MASTER_SWITCH.M1(W1_STATPULLDWN) R?.2
51 RED 8 AWG: 80A_GLV_MASTER_FUSE_GLVMS.1(1_GLVMS_12) LI-ION_12V_1.1(1_Bat1+_12) LI-ION_12V_2.1(1_Bat2+_12) LI-ION_12V_3.1(1_Bat3+_12)
52 RED 12 AWG: BRAKE_OVER_TRAVEL_SWITCH.1(1_BAT+_12) FRONT_PDU_8_Pin_MX150_PWR_IN.1(1_RBRB) FRONT_PDU_8_Pin_MX150_PWR_IN.2(2_RBRB) FRONT_PDU_8_Pin_MX150_PWR_IN.3(3_RBRB) FRONT_PDU_8_Pin_MX150_PWR_IN.4(4_RBRB) FRONT_PDU_8_Pin_MX150_PWR_IN.5(5_RBRB) X1_TOP_RPDU.11(11_RBRB_12) X1_TOP_RPDU.13(13_RBRB_12)
53 RED 12 AWG: COCKPIT_BRB.2(2_GLV_12) X1_TOP_RPDU.17(17_CPBRBIN_!2)
54 RED 20 AWG: X1_TOP_RPDU.12(12_SUSP) ; port Rear Wheels-RPDU.SUSP TRAVEL
55 RED 20 AWG: SSOK_FUSE_2A.1(1_SSOK_12) SSOK_LAMP_LEFT_GT150_2_PIN.1(1_SSOKL_12) SSOK_LAMP_RIGHT_GT150_2_PIN.1(1_SSOKR_12)
56 RED 12 AWG: COCKPIT_BRB.1(1_BAT+_12) IMD_SHUTDOWN_NO_HARNESS.2 SSOK_FUSE_2A.2
57 RED 14 AWG: port IGNITION COIL-GLVMS.IGNITION COIL 12V+
58 RED 20 AWG: FPDU_NonSw_20_Pin_MX150_PWR_OUT.10(10_LOG_12) ; port MABX-FPDU.LOGER 12V
Accelerator 1: PWR_OUT?.17 ; port Accelerator 1
Accelerator 2: PWR_OUT?.18 ; port Accelerator 2
AIR-: P?#3.3
ALREADY ON ENGINE: B?.1
Brake Press Transducer: PWR_OUT?.7 ; port Brake Press Transducer
BROWN 20 AWG: BOOTLOADER_AND_O2_GT150_2_PIN.1 MICROSQUIRT.34(O2)
CAN CHANNEL 2 H: ESS_CONTAINER_MX_150_2_PUIN_PANEL_CAN.1 ESS_CONTAINER_MX_150_2_PUIN_PANEL_CAN.2 J1_Kelly_Controller_14_Pin_Aviation_Plug.10(10_CANH) J1_Kelly_Controller_14_Pin_Aviation_Plug.11(11_CANL) P?#2.3(CANH) P?#2.4(CANL) X2_BOTTOM_RPDU.1(1_CANL) X2_BOTTOM_RPDU.2(2_CANH) ; port CAN CHANNEL 2.CANH, port CAN CHANNEL 2.CANL  [also labelled CAN CHANNEL 2 L]
CANduino Gyro Board: port Microsquirt, port CANduino Gyro Board, port CANduino IO Board, port MABX CAN CHANNEL 2, port RPDU, port KELLY CONTROLLER
CHARGER: P?#6.2
CLT: Enigne_MS_connector_10Pin_GT150.3(CLT) ETB_CONTROLLER_MX150_20_PIN.1(OUTA) ETB_CONTROLLER_MX150_20_PIN.7(PWM) ETB_GT150_6_PIN.5(MotorA) MICROSQUIRT.25(CLT) ; harness ETB POSITION.ETB PWM, harness Harness.ETB PWM  [also labelled MULTI COND WHITE SHEILDED 20 AWG]
Dash: PWR_OUT?.6 ; port Dash
Dash [0]: X031.4(SUP) ; port DASH SETTINGS.CANH, port MABX-DASH BUTTONS.SHIFT UP
Dash [1]: X031.5(SDN) ; port DASH SETTINGS.CANL, port MABX-DASH BUTTONS.SHIFT DOWN
Dash [2]: X031.10(CHARGE) ; port MABX-DASH BUTTONS.CHARGE
Dash [3]: X031.7(FORCEEV) ; port MABX-DASH BUTTONS.FORCE EV MODE
Dash [4]: X031.2(AUTOSHF) ; port MABX-DASH BUTTONS.AUTOSHIFT
Data Logger: PWR_OUT?.10 ; port Data Logger
Engine_Status[0]: MICROSQUIRT.5(LAUNCH_CTRL) ; harness ENGINE STATUS.LAUNCH CTRL  [also labelled PURPLE 20AWG]
Engine_Status[1]: ETB_CONTROLLER_MX150_20_PIN.10(INB) MICROSQUIRT.29(SPARK_CUT) ; harness ETB POSITION.ETB POS_B, harness ENGINE STATUS.SPARK CUT  [also labelled ETB POS_B, GREEN-BLK 20 AWG]
Engine_Tps[0]: ETB_GT150_6_PIN.1(Signal_out1) MICROSQUIRT.27(TPS) ; harness ENGINE STATUS.TPS0  [also labelled MULTI COND BLK SHEILDED 20 AWG, MULTI CONDSHEILDED RED 20 AWG]
Engine_Tps[1]: ETB_GT150_6_PIN.3(Signal_out2) ; harness ENGINE STATUS.TPS1  [also labelled MULTI COND SHEILDED BLK 20 AWG]
Engine_VRef[0]: 127_PIN_MABX_CONNECTOR_(see_excel_sheet).6(VDRIVE) Enigne_MS_connector_10Pin_GT150.7(VREF) ETB_CONTROLLER_MX150_20_PIN.11(11_ETBD) ETB_GT150_6_PIN.2(Signal_+5V) MICROSQUIRT.28(VREF) X1_TOP_RPDU.10(10_ETBD) ; harness ENGINE STATUS.VREF, port ICE SYSTEMS-RPDU.ETB DRIVER  [also labelled ETB 5V, VREF, VREF- JOIN WITH KRIMP]
ETB 12V: ETB_CONTROLLER_MX150_20_PIN.4(4_ETBC) X1_TOP_RPDU.3(3_ETBC) ; port ICE SYSTEMS-RPDU.ETB AND CONTROLLER
ETB POS_A: ETB_CONTROLLER_MX150_20_PIN.5(INA) ; harness ETB POSITION.ETB POS_A  [also labelled GREEN 20 AWG]
Gyro: PWR_OUT?.2 ; port Gyro
INJ 12V: Enigne_MS_connector_10Pin_GT150.22(INJ_12V) X1_TOP_RPDU.6(6_INJ) ; port ICE SYSTEMS-RPDU.INJECTOR
MABX: PWR_OUT?.8 ; port MABX
MABX CAN CHANNEL 1: port Raspberry Pi, port Vector CanCaseXL Log, port MABX CAN CHANNEL 1
MABX Ref: PWR_OUT?.16 ; port MABX Ref
MAP: Enigne_MS_connector_10Pin_GT150.1(VR_+) Enigne_MS_connector_10Pin_GT150.2(VR_-) Enigne_MS_connector_10Pin_GT150.5(MAP) Enigne_MS_connector_10Pin_GT150.8(INJ_1) MICROSQUIRT.9(INJ1) MICROSQUIRT.12(IGN1) MICROSQUIRT.24(MAP) MICROSQUIRT.32(VR1+) MICROSQUIRT.33(VR1-)  [also labelled WHITE SHEILDED 20 AWG]
MAT: Enigne_MS_connector_10Pin_GT150.4(MAT) MICROSQUIRT.26(MAT)  [also labelled MULTI COND RED SHEILDED 20 AWG]
Mesh: PWR_OUT?.9 ; port Mesh
MIDPACK: P?#6.3
MIDPACK_ALLOWED: P?#5.1
MIDPACK_IN: P?#5.2
MULTI COND BLACK SHEILDED 20 AWG: ETB_CONTROLLER_MX150_20_PIN.2(OUTB) ETB_GT150_6_PIN.6(MotorB)
ORANGE 20 AWG: ETB_CONTROLLER_MX150_20_PIN.6(ENA/DIAGA) ; harness ETB POSITION.ENA, harness Harness.ENA
PACK+: P?#3.2
Pi: PWR_OUT?.1 ; port Pi
PRECHARGED: P?#5.3
PURPLE 20 AWG: ETB_CONTROLLER_MX150_20_PIN.9(ENB/DIAGB) Shift_Piston_4_Pin_GT150.3(3_SHFTUPSNS) Shift_Piston_4_Pin_GT150.4(4_SHFTDNSNS) U?#1.2(Output) U?#2.2(Output) ; harness ETB POSITION.ENB, port MABX-ICE SYSTEMS.SHIFT UP SENSE, port MABX-ICE SYSTEMS.SHIFT DOWN SENSE, harness Harness.ENB  [also labelled Shift_Sense0, Shift_Sense1]  [project net Dash 0]
SER GND: MICROSQUIRT.19(SERIAL_GND) Serial_Connector_3.5mm_JACK.5(GND) ; port SER GND
Susp Travel L: PWR_OUT?.14 ; port Susp Travel L
Susp Travel R: PWR_OUT?.15 ; port Susp Travel R
TS+: P?#6.1
Wheel Speed L: PWR_OUT?.12 ; port Wheel Speed L
Wheel Speed R: PWR_OUT?.13 ; port Wheel Speed R
WHITE-BLK 20 AWG: BOOTLOADER_AND_O2_GT150_2_PIN.2 MICROSQUIRT.15(Bootloader)
Net20A_STATOR_FUSE_2: 20A_STATOR_FUSE.2(2_STATFUS) GLVMS_GROUNDED_LOW_VOLTAGE_MASTER_SWITCH.Z1(Z1_STATTOBAT)
Net?#1_1: ?#1.1(A) P?#1.5
Net?#2_1: ?#2.1(CAN_H) DashConnector.1(CAN_H)
NetAMS?_1: AMS?.1 KELLY_J1.1 MICROS.1 RPDU.2
NetAMS?_2: AMS?.2 KELLY_J1.2 MICROS.2 RPDU.1
NetAMS_SHUTDOWN_NO_HARNESS_2: AMS_SHUTDOWN_NO_HARNESS.2 IMD_SHUTDOWN_NO_HARNESS.1
NetBIG_CABLE_GLANDS_1: BIG_CABLE_GLANDS.1(TS+) Motor_Controller_Al_Bars.1(B+) Motor_Terminals.B+ ; port ISO-KELLY.TS+
NetBIG_CABLE_GLANDS_2: BIG_CABLE_GLANDS.2(TS-) Motor_Controller_Al_Bars.3(B-)
NetCANCaseXL_Log_Binder_Connector_1: CANCaseXL_Log_Binder_Connector.1(+12V) ; port MID VEHICLE PWR.LOGGER 12V
NetCanConnecter_front_1: CanConnecter_front.1(CAN_H) MABX.1(CAN_H)
NetCanConnecter_front_3: CanConnecter_front.3(CAN_L) MABX.2(CAN_L)
NetD-SUB9_CANCaseXL_2: D-SUB9_CANCaseXL.2(CANL) D-SUB9_CANCaseXL_Log.2(CANL) ; port CAN CHANNEL 1.CANL
NetD-SUB9_CANCaseXL_7: D-SUB9_CANCaseXL.7(CANH) D-SUB9_CANCaseXL_Log.7(CANH) ; port CAN CHANNEL 1.CANH
NetENGINE_STATOR_MOTOR_SPADE_1: ENGINE_STATOR_MOTOR_SPADE.1 STATOR_RECTIFIER.7(Stator_A)
NetENGINE_STATOR_MOTOR_SPADE_2: ENGINE_STATOR_MOTOR_SPADE.2 STATOR_RECTIFIER.8(Stator_B)
NetESS_CONTAINER_10_PIN_MX150_PANEL_MOUNT_1: ESS_CONTAINER_10_PIN_MX150_PANEL_MOUNT.1(TSMS_12V) ESS_CONTAINER_10_PIN_MX150_PANEL_MOUNT.2(TSMS_12V) TSMS_MOUNTED_ON_ESS_CONTAINER.1(COMMON)
NetFPDU_NonSw_20_Pin_MX150_PWR_OUT_1: FPDU_NonSw_20_Pin_MX150_PWR_OUT.1(1_PI_5) ; port TELEMETRY.PI 5V
NetFPDU_NonSw_20_Pin_MX150_PWR_OUT_2: FPDU_NonSw_20_Pin_MX150_PWR_OUT.2(2_GYRO_5) ; port TELEMETRY.GYRO 5V
NetFPDU_NonSw_20_Pin_MX150_PWR_OUT_6: FPDU_NonSw_20_Pin_MX150_PWR_OUT.6(6_DASH_12) P?#2.2(+12V) ; port DASH-FPDU.DASH 12V
NetFPDU_NonSw_20_Pin_MX150_PWR_OUT_9: FPDU_NonSw_20_Pin_MX150_PWR_OUT.9(9_MESH_12) ; port TELEMETRY.MESH 12V
NetLEFT_BRB_1: LEFT_BRB.1(1_RBRB_12) RIGHT_BRB.2(2_RBRB)
NetMAIN_INSTRUMENTATION_FUSE_40A_2: MAIN_INSTRUMENTATION_FUSE_40A.2(2_INSTFU) RIGHT_BRB.1(1_RBRB)
NetMICROSQUIRT_1: MICROSQUIRT.1(1_MS_12) X2_BOTTOM_RPDU.7(7_MS) ; port ICE SYSTEMS-RPDU.MS
NetMICROSQUIRT_13: MICROSQUIRT.13(RxOut) Serial_Connector_3.5mm_JACK.2(Rx)
NetMICROSQUIRT_14: MICROSQUIRT.14(TxOut) Serial_Connector_3.5mm_JACK.3(Tx)
NetMotor_Controller_Al_Bars_2: Motor_Controller_Al_Bars.2(M-) Motor_Terminals.M- ; port ISO-KELLY.TS-
NetP?#1_5V PWR: P?#1.5V_PWR(3) ; port TELEMETRY-FPDU.PI 5V
NetP?#1_CAN H: P?#1.CAN_H(1) ; port TELEMETRY-MABX.CAN H
NetP?#1_CAN L: P?#1.CAN_L(2) ; port TELEMETRY-MABX.CAN L
NetP?#7_3: P?#7.3 X2_BOTTOM_RPDU.8(8_SHFTUP) ; port ICE SYSTEMS-RPDU.SHIFT UP
NetP?#7_4: P?#7.4 X2_BOTTOM_RPDU.3(3_SHFTDN) ; port ICE SYSTEMS-RPDU.SHIFTDN
NetShift_Piston_4_Pin_GT150_1: Shift_Piston_4_Pin_GT150.1(1_SHFTR) X1_TOP_RPDU.4(4_SHFTR) ; port ICE SYSTEMS-RPDU.SHIFTER HES
NetSPARK_PLUG_1: SPARK_PLUG.1(+12V) SPARK_PLUG_COIL.3(HV_TO_PLUG)
NetSPARK_PLUG_COIL_1: SPARK_PLUG_COIL.1(+12V_______5) SparkPlugCoil_Connector.1(5____(+12V))
NetSPARK_PLUG_COIL_2: SPARK_PLUG_COIL.2(TTL_GND___2) SparkPlugCoil_Connector.3(2____TTL_GRND)
NetSPARK_PLUG_COIL_4: SPARK_PLUG_COIL.4(BATT_GRND____4) SparkPlugCoil_Connector.5(4____BATT_GRND)
NetSPARK_PLUG_COIL_5: SPARK_PLUG_COIL.5(IGN_Trigger) SparkPlugCoil_Connector.2(1___IGN_TRIG)
NetSPARK_PLUG_COIL_6: SPARK_PLUG_COIL.6(CYL_HEAD_GND_____3) SparkPlugCoil_Connector.4(3___CYL_HEAD_GRND)
NetTSAL_1: TSAL.1 TSAL_GT150_2_PIN.2
NetTSAL_2: TSAL.2 TSAL_GT150_2_PIN.4
NetU?#1_1: U?#1.1(+5V) U?#2.1(+5V)
NetU?#1_3: U?#1.3(GND) U?#2.3(GND)
NetX1_TOP_RPDU_5: X1_TOP_RPDU.5(5_FPOUT) ; port ICE SYSTEMS-RPDU.FPOUT
NetX1_TOP_RPDU_7: X1_TOP_RPDU.7(7_IGN) ; port ICE SYSTEMS-RPDU.IGNITION SUPPLY
NetX031_6: X031.6(START) ; port MABX-DASH BUTTONS.START
NetX031_9: X031.9(ENGSTART) ; port MABX-DASH BUTTONS.ENGINE START
NetX043_1: X043.1(+5V) ; port MID VEHICLE PWR.GYRO 5V

Not connected (* = marked no-connect by the designer): 127_PIN_MABX_CONNECTOR_(see_excel_sheet) 3(Digital_In) 4(Analog_In) 5(Digital_Out); ?#2 2(CAN_L); AMS_14_PIN_HEADER 1(TSMS_12V) 2(TSMS_12V) 3(RBRB_12V) 4(RBRB_12V) 5(AMS_STATUS) 6(CAN_H) 7(CAN_L) 8(CT_SENSE_1) 9(CT_SENSE_2) 10(GND) 11(GND) 12(GND) 13(GND) 14(GND); AMS_SHUTDOWN_NO_HARNESS 3; B? 2; BINDER_CONNECTOR_CAN_CaseXL 1(12V+) 2(EXT_TRIG_5V); BINDER_CONNECTOR_CAN_CaseXL_Log 1(12V+) 2(EXT_TRIG_5V); BRAKE_LIGHT_GT150_2_PIN 3; Brake_Solenoid 1(12V_Power) 2(Ground); CanConnecter_front 2 4; CanConnector_Rear 1(CAN_H) 2(CAN_H) 3(CAN_L) 4(CAN_L); D-SUB9_CANCaseXL 1 4 5 6 8 9; D-SUB9_CANCaseXL_Log 1 4 5 6 8 9; DashConnector 2 3(CAN_L) 4; Engine_Fan 1(12V_Power) 2(Ground); Enigne_MS_connector_10Pin_GT150 9 10 12(12_INJ) 13 14 17 18 24 26(GND); ESS_CONTAINER_10_PIN_MX150_PANEL_MOUNT 8(CT_SENSE_1) 9(CT_SENSE_2); ETB_CONTROLLER_MX150_20_PIN 8(CS) 13(VOUT); FPDU_NonSw_20_Pin_MX150_PWR_OUT 3(3_SPR_5) 4(4_SPR_12) 5(5_SPR_12) 11(11_SPR_5) 19(19_SPR_5) 20(20_SPR_5); IMD_PANEL MHS(5) MLS(6) NC(7); IMD_SHUTDOWN_NO_HARNESS 3; J1_Kelly_Controller_14_Pin_Aviation_Plug ALARM <.2A(4) CURRENT METER (<.2A(2) GREEN LED(6) MAIN CONTACT DRIVER <2A(3) PWR OUT(1) RED LED(14) RESERVED(8); J2_Kelly_Controller_14_Pin_Aviation_Plug 5V SUPPLY OUT <.05A(7) BRAKE SWITCH INPUT(10) MICRO_SW THROTTLE SWITCH INPUT(8) MOTOR TEMP IN(4) RESERVED(11) REVERSING SWITCH INPUT(9); LEFT_BRB 2(2_INST_12); MICROSQUIRT 2(CANH) 3(CANL) 4(VRIN2+) 6(FLEX_FUEL) 7(FIDLE) 8(FUEL_PUMP) 10(INJ_2) 11(IGN_2) 16(ACCEL_LED) 17(WARM_LED) 18(N/C) 30(OPTO_IN+) 31(OPTO_IN-) 35(TACH_OUT); P?#1 6 7 8 9 10; P?#3 1; P?#4 1 2; P?#7 1 2 6; RAS_PI 1(CAN_H) 2(CAN_L); RESET 1(1_AMSLED) 2(2_IMDLED) 3(3_RELAYPW) 4(4_RELAYPW) 5(5_CPBRB) 6(6_CPBRB); SparkPlugCoil_Connector 6(6________Spare_Grnd); STARTER_RELAY_SPST 3 4; STATOR_RECTIFIER 9(Rectifier_Red) 10(Rectifier_Green) 11(Rectifier_White); X1_TOP_RPDU 2 8(8_COIL) 20(20_CPBRB_12); X2_BOTTOM_RPDU 4 13 14 15(15_SPR_5) 18(18_SPR1); X031 1(+12V) 3 8 11(GND) 12(RTDS) 13(+5V_Switches) 14(+5V_Raspberry_Pi_In) 15(+5V_Raspberry_Pi_Out) 16(Infotainment_Soft_Reset_Out) 17(IMDLED) 18(AMSLED) 19 20

## Buses and harness runs
bus BrakePressure[0..1] = Engine_Tps[0..1] = ETB_Position[0...1] = PedalPot[0..2] = Vehicle_5V_Ref[0]
bus Dash [0..1] = Dash [0..4] = Shift_Sense[0..1]
bus Engine_Status[0...1]
bus WheelSpeed[0..3]

## Notes on the sheet
- ALL GND'S TO BE BLK 16 AWG TO CHASSIS GROUNDING POINTS
- RULE EV5.2: No GLV and TS in same conduit or connector
- CAN LEGEND
- Not Ready for Harness Do Not Pin
- FPDU
- (near FRONT_PDU_8_Pin_MX150_PWR_IN) PWR Pin 1-5
- (near X031) Maybe should consider adding a toggle switch thats integrated into the dash for the brake solenoid parking brake.
- (near FRONT_PDU_8_Pin_MX150_PWR_IN) GND Pin 6-8
- AMS/IMD NO Relays RPDU ENCLOSURE
- Rear PDU
- Shutdown Circuit
- Relays are in the RPDU enclosure
- connecto to spare
- CAN NETWORK OVERVIEW
- FRONT WHEELS
- REAR WHEELS
- Internal connections are harness design low priority. The ESS team will have to design the internal harness with extreme care!
- (near P?#3) fully contained in ess container
- (near Motor_Terminals) Motor
- Shielded Dual Insulated Cable
- EV9.1.10 requires grounding of iso board
- D-sub 9 connector is pin 2 ->orange
- YELLOW =>
- DelPhi 3 pin connector is pin 1 -> CANL
- pin 3 -> red
- pin 7 -> purple
- pin 2 -> CANH
- RED =>
- pin 3 -> Ground
- DO NOT POWER EXT TRIGGER WITH 12V
- Important Notes about new(Mar 2018) Flex-a-lite Engine fan.
  - To be used as a puller fan blue or red wire is (+), making black (-)
  - Manufacturer recommends it be run on 12V positive ignition controlled source with a 20Amp inline fuse.
- (near Engine_Fan) Red 16 AWG
- (near Engine_Fan) Black 16 AWG
- (near Brake_Solenoid) Red 16 AWG
- (near Brake_Solenoid) Black 16 AWG
- <=====This is not accurator to how it presents on the car wiring!
- According to the testing chad did we can run the smart coil's +12V through RDPU.
- Determine Apropriate MABX Pins
- Labels drawn without touching a wire or pin: 24 RED 20 AWG, 43 RED 12 AWG, 44 RED 12 AWG, 48 RED 16 AWG, HIGH: BLUE LOW: BROWN, HIGH: PURPLE LOW: YELLOW, WheelSpeed[0..3], WHITE SHEILDED 20 AWG
- Title
- Size:
- Date:
- File:
- C
- Number:
- Time:
- Revision:
- Sheet
- of
- (in symbol Motor) M

## Library data of the parts
20A_STATOR_FUSE 80A_GLV_MASTER_FUSE_GLVMS MAIN_INSTRUMENTATION_FUSE_40A SSOK_FUSE_2A = Fuse 2: Fuse; Published: 8-Jun-2000; LatestRevisionDate: 17-Jul-2002; LatestRevisionNote: Re-released for DXP Platform.; PackageReference: PIN-W2/E2.8; Publisher: Altium Limited; PackageDescription: Thru-Hole; 2 Leads
?#1 = Antenna: Generic Antenna; Published: 24-Mar-1999; LatestRevisionDate: 17-Jul-2002; LatestRevisionNote: Re-released for DXP Platform.; PackageReference: PIN1; Publisher: Altium Limited
?#2 AMS? KELLY_J1 MABX MICROS RAS_PI RPDU = Header 2H: Header, 2-Pin, Right Angle; LatestRevisionDate: 17-Jul-2002; LatestRevisionNote: Re-released for DXP Platform.; Publisher: Altium Limited
Accelerator_Pot_1_GT_150_3_Pin Accelerator_Pot_2_GT_150_3_Pin = Pedal_Pot
AMS_SHUTDOWN_NO_HARNESS IMD_SHUTDOWN_NO_HARNESS STARTER_RELAY_SPST = Relay-SPST: Single-Pole Single-Throw Relay; Published: 24-Mar-1999; LatestRevisionDate: 17-Jul-2002; LatestRevisionNote: Re-released for DXP Platform.; PackageReference: MODULE4; Publisher: Altium Limited
B? STARTER_MOTOR = Motor: Motor, General Kind; Published: 24-Mar-1999; LatestRevisionDate: 17-Jul-2002; LatestRevisionNote: Re-released for DXP Platform.; Publisher: Altium Limited
  B?: PackageReference: RB5-10.5; PackageDescription: Capacitor (Radial); 2 Leads
BIG_CABLE_GLANDS Brake_Solenoid Engine_Fan ESS_Container_MX_150_2_PIN_PANEL_ISO ESS_CONTAINER_MX_150_2_PUIN_PANEL_CAN ESS_Container_MX_150_2PIN_PANEL_IMD IMD_MX150_2PIN_PANEL_(_need_to_confirm_) ISO_BOARD_CABLE_GLAND_1-ISO_BOARD_CABLE_GLAND_3 P?#4 TS_IN = Header 2: Header, 2-Pin; LatestRevisionDate: 17-Jul-2002; LatestRevisionNote: Re-released for DXP Platform.; Publisher: Altium Limited
  ISO_BOARD_CABLE_GLAND_1: Supplier Part Number 1: 277-1721-ND
BINDER_CONNECTOR_CAN_CaseXL BINDER_CONNECTOR_CAN_CaseXL_Log BRAKE_LIGHT_GT150_2_PIN FL_SUSP_TRAVEL_GT_150_3PIN FR_SUSP_TRAVEL_GT_150_3PIN Motor_Controller_Al_Bars P?#3 P?#5 P?#6 RL_SUSP_TRAVEL_GT_150_3PIN RR_SUSP_TRAVEL_GT_150_3PIN = Header 3: Header, 3-Pin; LatestRevisionDate: 17-Jul-2002; LatestRevisionNote: Re-released for DXP Platform.; Publisher: Altium Limited
BOOTLOADER_AND_O2_GT150_2_PIN ENGINE_STATOR_GT150_2_PIN ENGINE_STATOR_MOTOR_SPADE = 2 Pin Connector: ComponentLink1Description: Manufacturer Link
BRAKE_OVER_TRAVEL_SWITCH TSMS_MOUNTED_ON_ESS_CONTAINER = SW-SPST: Single-Pole, Single-Throw Switch; Published: 24-Mar-1999; LatestRevisionDate: 17-Jul-2002; LatestRevisionNote: Re-released for DXP Platform.; PackageReference: SPST-2; Publisher: Altium Limited; PackageDescription: Switch; 2 Leads
Brake_Solenoid_2Pin_GT150 CANCaseXL_Log_Binder_Connector Engine_Fan_Connector SPARK_PLUG SSOK_LAMP_LEFT_GT150_2_PIN SSOK_LAMP_RIGHT_GT150_2_PIN Starter_Relay_GT150_2_PIN = 12V_Load
CanConnecter_front CanConnector_Rear DashConnector TSAL_GT150_2_PIN = Header 2X2: Header, 2-Pin, Dual row; LatestRevisionDate: 17-Jul-2002; LatestRevisionNote: Re-released for DXP Platform.; Publisher: Altium Limited
COCKPIT_BRB LEFT_BRB RIGHT_BRB = SW-PB: Switch; Published: 24-Mar-1999; LatestRevisionDate: 17-Jul-2002; LatestRevisionNote: Re-released for DXP Platform.; PackageReference: SPST-2; Publisher: Altium Limited; PackageDescription: Switch; 2 Leads
D-SUB9_CANCaseXL D-SUB9_CANCaseXL_Log = Header 9: Header, 9-Pin; LatestRevisionDate: 17-Jul-2002; LatestRevisionNote: Re-released for DXP Platform.; Publisher: Altium Limited
Enigne_MS_connector_10Pin_GT150 = Engine harness connector: Capacitor; Value: 100pF; Published: 8-Jun-2000; LatestRevisionDate: 17-Jul-2002; LatestRevisionNote: Re-released for DXP Platform.; PackageReference: RAD-0.3; Publisher: Altium Limited; PackageDescription: Radial Cap, Thru-Hole; 2 Leads; 0.3 in Pin Spacing
ETB_CONTROLLER_MX150_20_PIN = ETB_Controller
ETB_GT150_6_PIN = ETB
F_BrakePressureTransducer_3_Pin_GT150 R_BrakePressureTransducer_3_Pin_GT150 = BrakePressureTransducer
FL_Wheel_speed_Sensor_3_Pin_GT_150 FR_Wheel_speed_Sensor_3_Pin_GT_150 = Wheel_Speed_Sensor
FPDU_NonSw_20_Pin_MX150_PWR_OUT = Non-Sw-RBRB
FRONT_PDU_8_Pin_MX150_PWR_IN IMD_PANEL = Header 8: Header, 8-Pin; LatestRevisionDate: 17-Jul-2002; LatestRevisionNote: Re-released for DXP Platform.; Publisher: Altium Limited
GLVMS_GROUNDED_LOW_VOLTAGE_MASTER_SWITCH = GLVMS
J1_Kelly_Controller_14_Pin_Aviation_Plug J2_Kelly_Controller_14_Pin_Aviation_Plug = Header 14: Header, 14-Pin; LatestRevisionDate: 17-Jul-2002; LatestRevisionNote: Re-released for DXP Platform.; Publisher: Altium Limited
LI-ION_12V_1-LI-ION_12V_3 = 12V_Battery
Motor_Terminals = MHDR1X2: Header, 2-Pin; LatestRevisionDate: 17-Jul-2002; LatestRevisionNote: Re-released for DXP Platform.; Publisher: Altium Limited
P?#1 = Header 10: Header, 10-Pin; LatestRevisionDate: 17-Jul-2002; LatestRevisionNote: Re-released for DXP Platform.; Publisher: Altium Limited
P?#2 = 4-Pin Connector
P?#7 REAR_WHEEL_SPEED_SENSORS_GT150_6_PIN RESET SparkPlugCoil_Connector = Header 6: Header, 6-Pin; LatestRevisionDate: 17-Jul-2002; LatestRevisionNote: Re-released for DXP Platform.; Publisher: Altium Limited
PWR_OUT? = Header 20: Header, 20-Pin; LatestRevisionDate: 17-Jul-2002; LatestRevisionNote: Re-released for DXP Platform.; Publisher: Altium Limited; Supplier 1: Mouser
R? = Res1: Resistor; Value: 4R; Published: 8-Jun-2000; LatestRevisionDate: 17-Jul-2002; LatestRevisionNote: Re-released for DXP Platform.; PackageReference: AXIAL-0.3; Publisher: Altium Limited; PackageDescription: Axial Device, Thru-Hole; 2 Leads; 0.3 in Pin Spacing
Shift_Piston_4_Pin_GT150 = 4 Pin Connector: Capacitor; Published: 8-Jun-2000; LatestRevisionDate: 17-Jul-2002; LatestRevisionNote: Re-released for DXP Platform.; PackageReference: RAD-0.3; Publisher: Altium Limited; PackageDescription: Radial Cap, Thru-Hole; 2 Leads; 0.3 in Pin Spacing
TSAL = Lamp: Incandescent Bulb; Published: 24-Mar-1999; LatestRevisionDate: 17-Jul-2002; LatestRevisionNote: Re-released for DXP Platform.; PackageReference: PIN2; Publisher: Altium Limited
U?#1 U?#2 = Shifter_HallSensor
X1_TOP_RPDU X2_BOTTOM_RPDU = Switched 20pin
X031 = Dash_Connector
X043 = 5V LOAD